# EAGLE board SP-PC (EAGLE 7.6.0), part 1 of 2
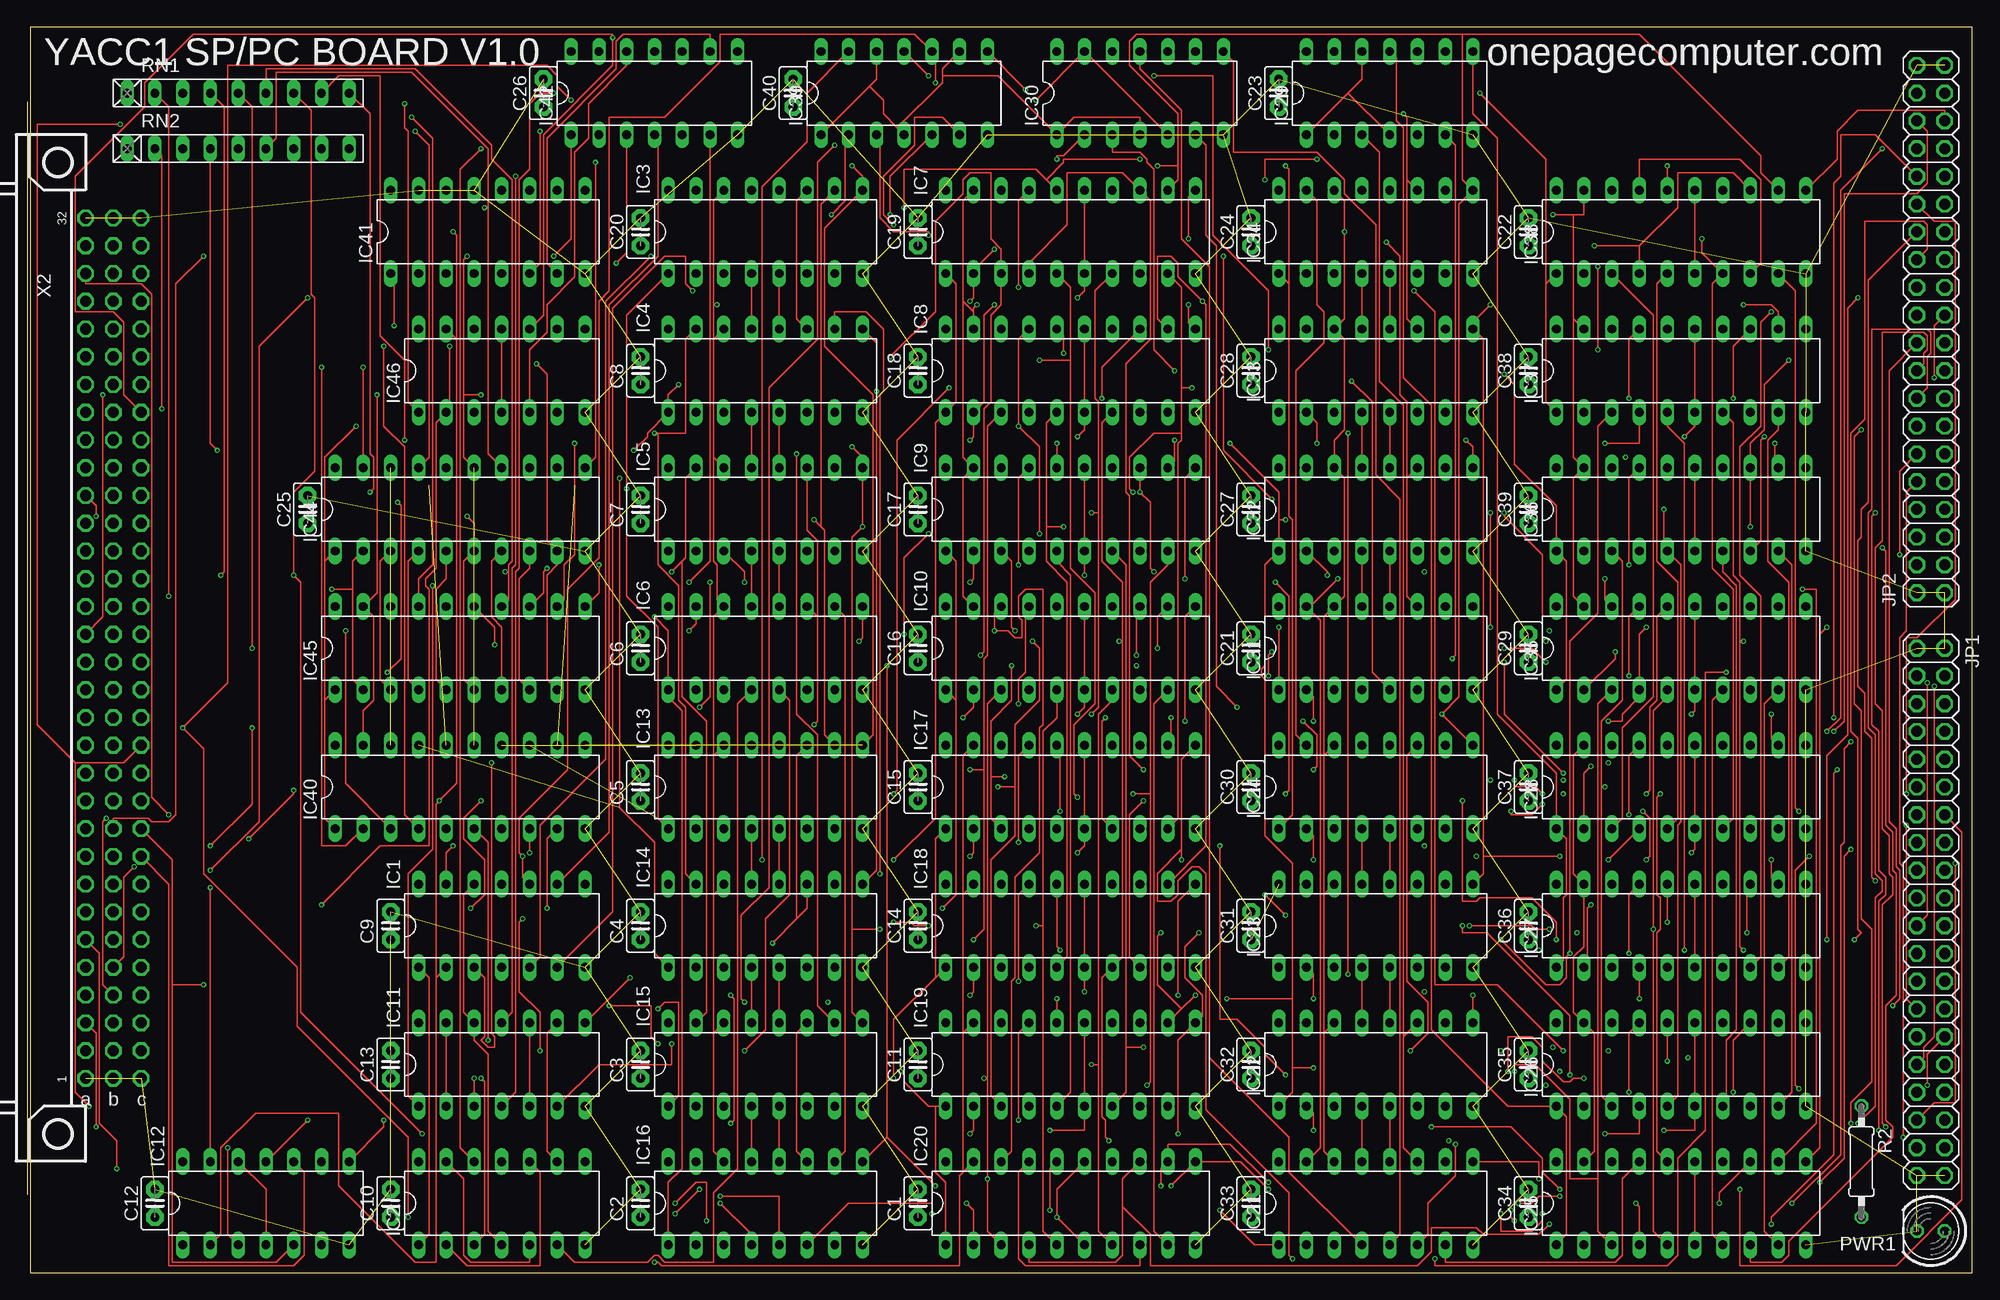
[diagram p7: board, top side]
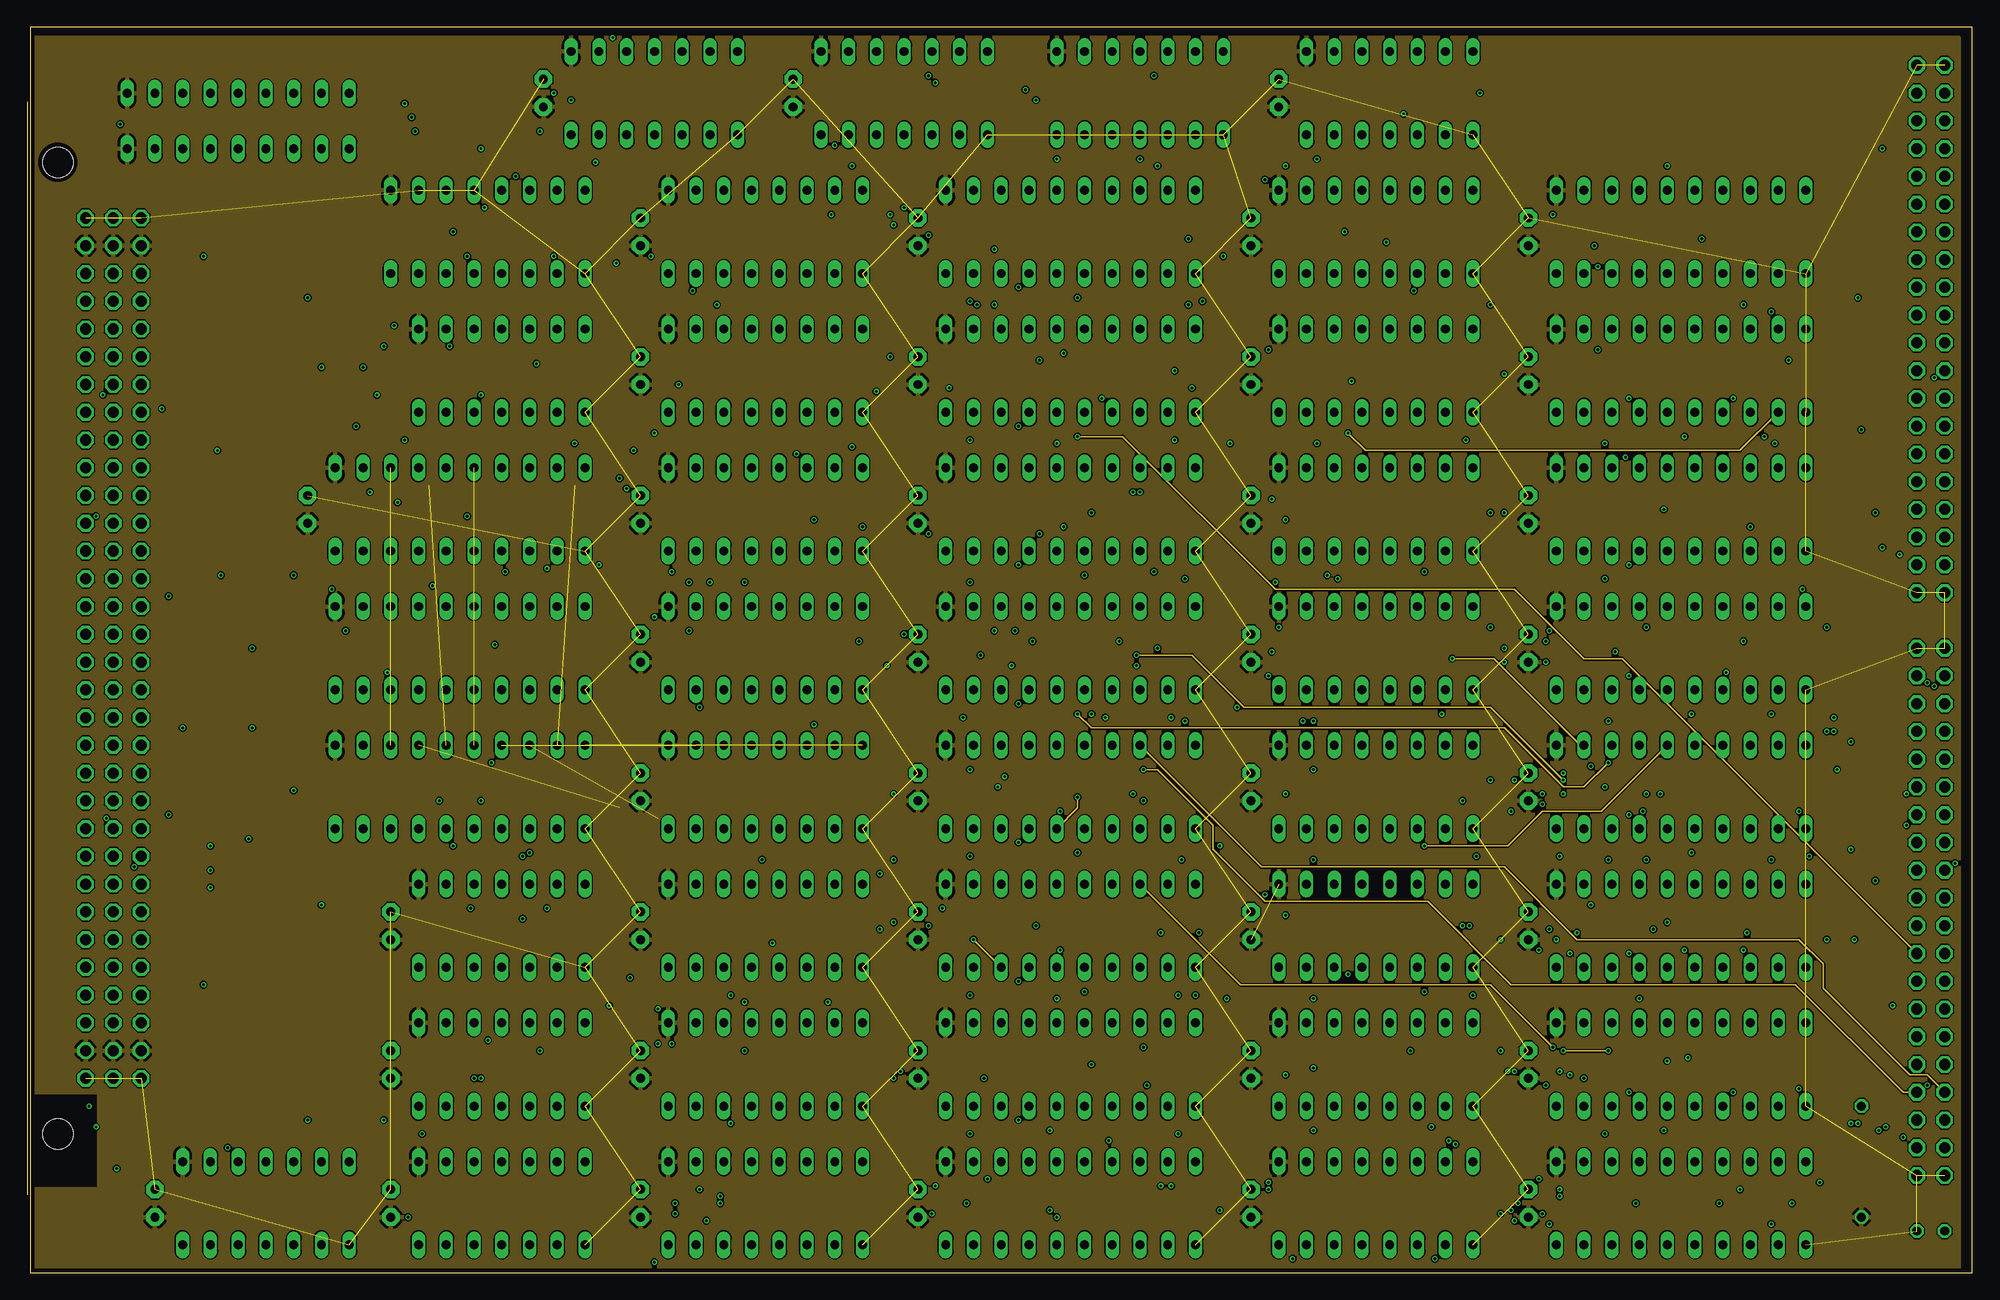
[diagram p8: board, inner layer Route2]
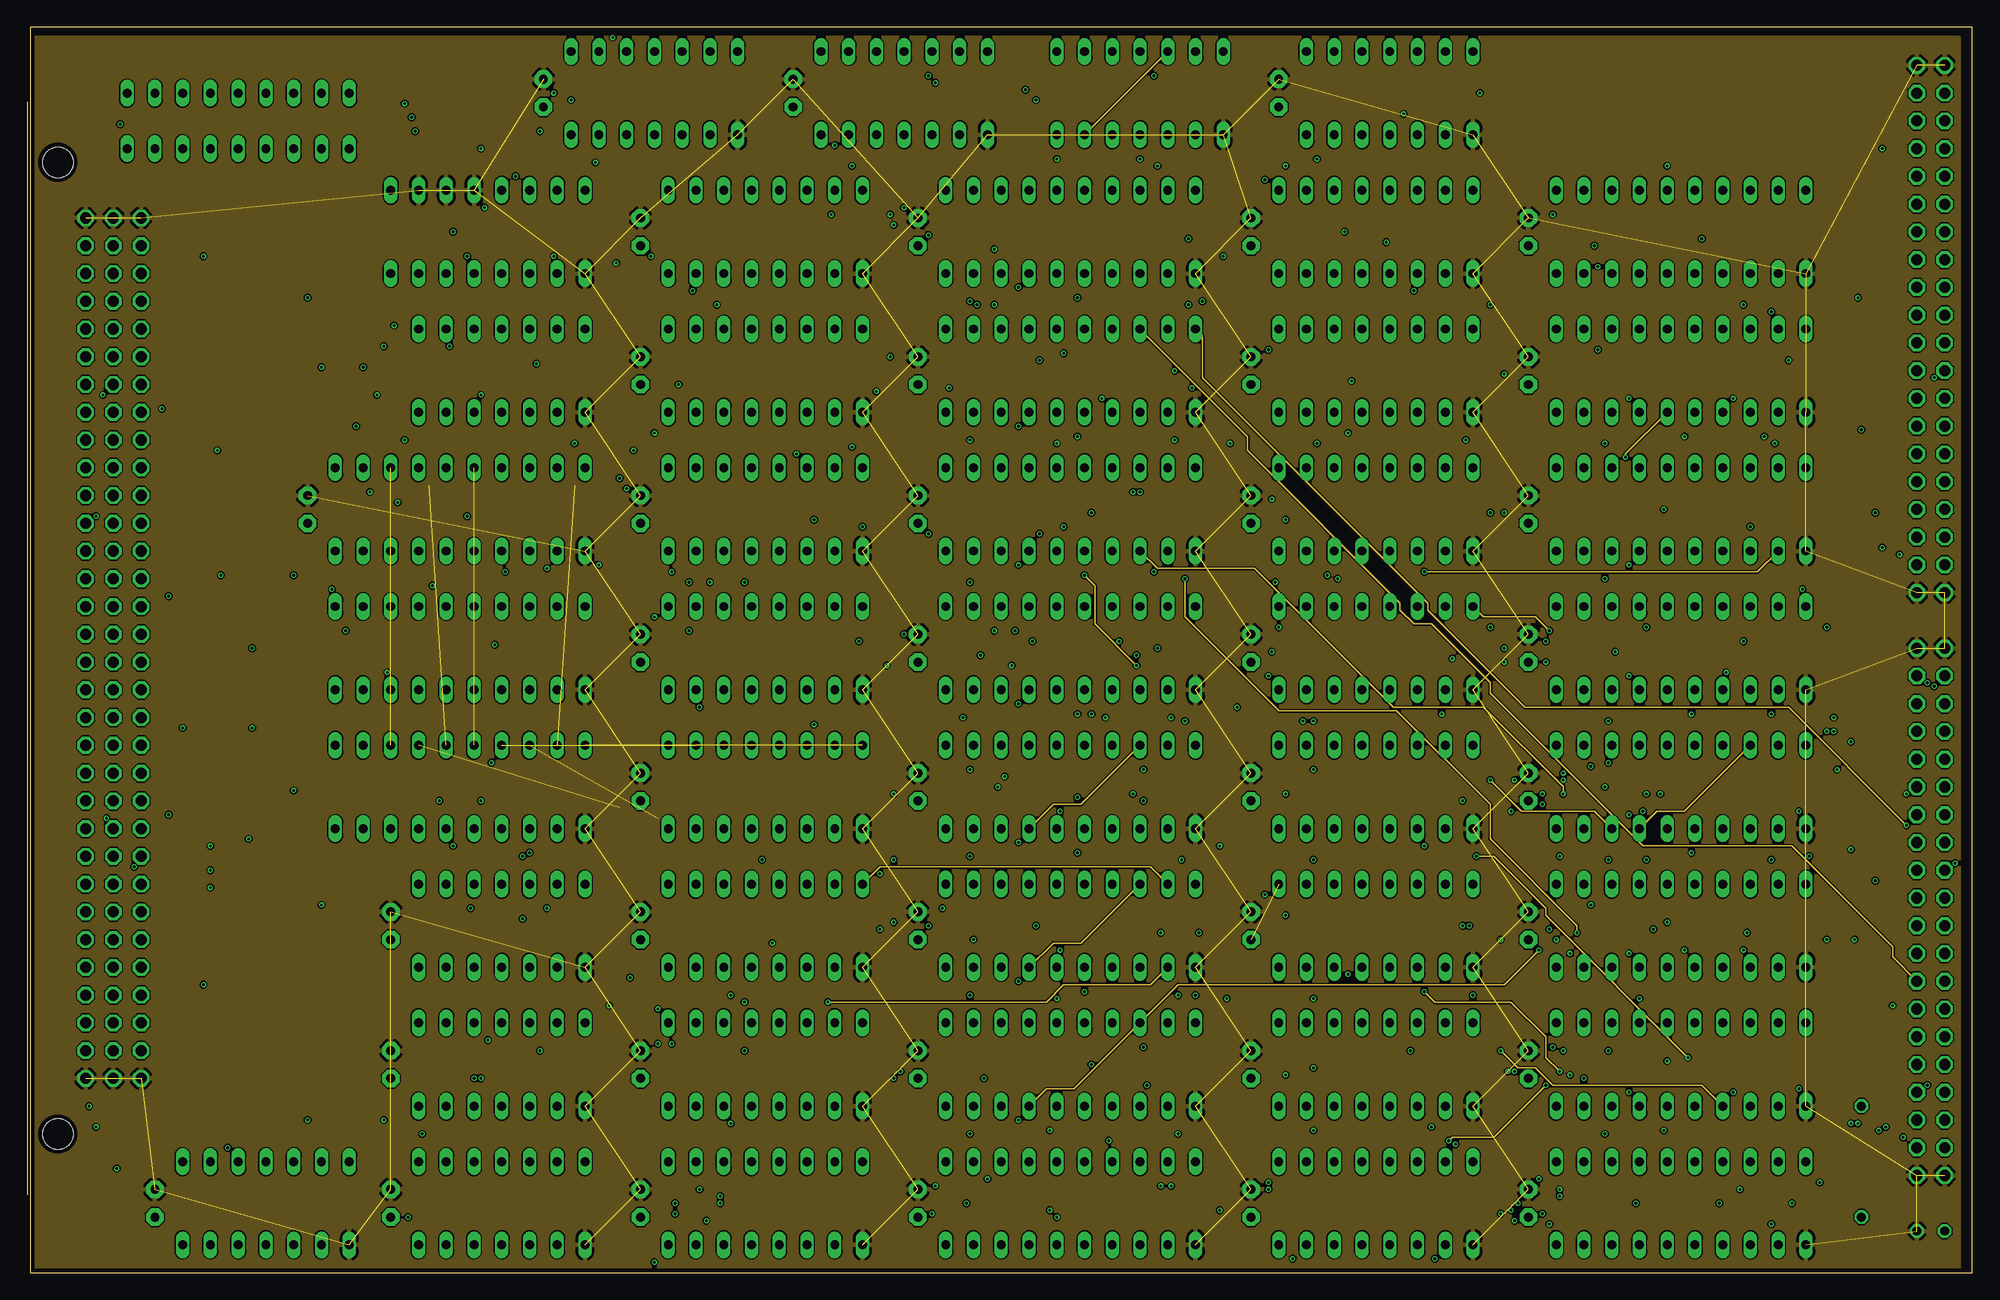
[diagram p9: board, inner layer Route15]
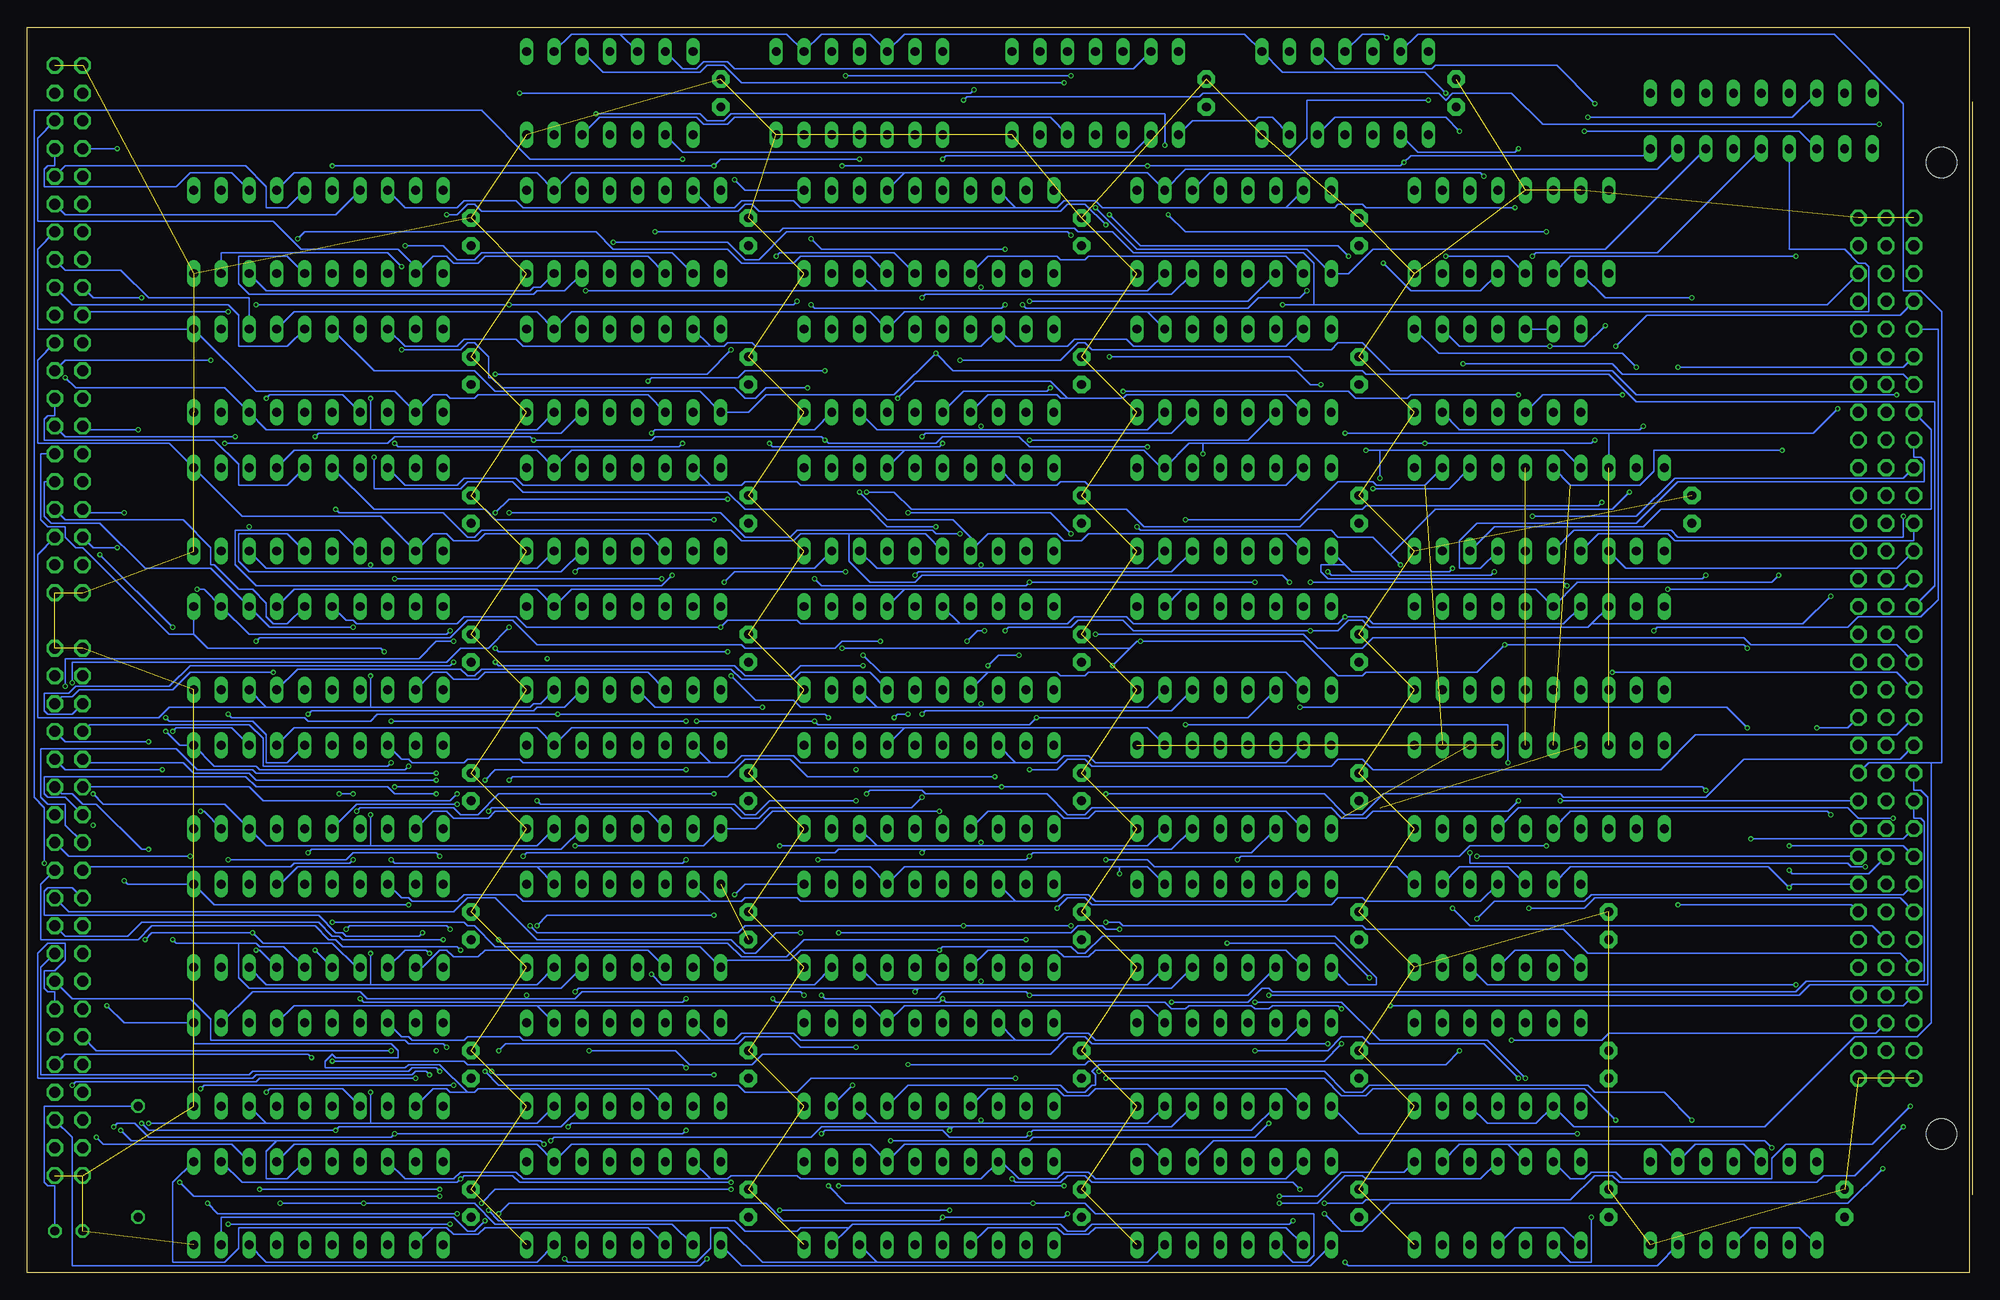
[diagram p10: board, bottom side, seen from below]

Size 177.78 x 113.97 mm. Coordinates in mm from the lower left corner, seen from the top.
Outline: 0,0 177.78,0 177.78,113.97 0,113.97 0,0
Copper layers (1*2*15*16): Top 0.035559375mm / dielectric 0.17018125mm / Route2 0.01778125mm / dielectric 47mil / Route15 0.01778125mm / dielectric 0.17018125mm / Bottom 0.035559375mm
Design rules "OSHPark-4layer": minimum track width 5mil, minimum drill 10mil, track to track 5mil, track to pad 5mil, pad to pad 5mil, via to via 5mil, smd to smd 5mil, copper to edge 15mil, drill to drill 6mil, minimum pad ring 4mil, minimum via ring 4mil, stop-mask expansion 2.5mil, vias tented up to drill 0mil, thermal gap 10mil

## Footprints (pad centres in the part's own frame; a part is rotated, then mirrored left to right if it is on the bottom)
C2.5-2 = drill 0.813 pad 1.6 octagon: 1 -1.27,0; 2 1.27,0
DIL14 = drill 0.813 long: 1 -7.62,-3.81; 2 -5.08,-3.81; 3 -2.54,-3.81; 4 0,-3.81; 5 2.54,-3.81; 6 5.08,-3.81; 7 7.62,-3.81; 8 7.62,3.81; 9 5.08,3.81; 10 2.54,3.81; 11 0,3.81; 12 -2.54,3.81; 13 -5.08,3.81; 14 -7.62,3.81
DIL16 = drill 0.813 long: 1 -8.89,-3.81; 2 -6.35,-3.81; 3 -3.81,-3.81; 4 -1.27,-3.81; 5 1.27,-3.81; 6 3.81,-3.81; 7 6.35,-3.81; 8 8.89,-3.81; 9 8.89,3.81; 10 6.35,3.81; 11 3.81,3.81; 12 1.27,3.81; 13 -1.27,3.81; 14 -3.81,3.81; 15 -6.35,3.81; 16 -8.89,3.81
DIL20 = drill 0.813 long: 1 -11.43,-3.81; 2 -8.89,-3.81; 3 -6.35,-3.81; 4 -3.81,-3.81; 5 -1.27,-3.81; 6 1.27,-3.81; 7 3.81,-3.81; 8 6.35,-3.81; 9 8.89,-3.81; 10 11.43,-3.81; 11 11.43,3.81; 12 8.89,3.81; 13 6.35,3.81; 14 3.81,3.81; 15 1.27,3.81; 16 -1.27,3.81; 17 -3.81,3.81; 18 -6.35,3.81; 19 -8.89,3.81; 20 -11.43,3.81
2X20 = drill 1.016 octagon: 1 -24.13,-1.27; 2 -24.13,1.27; 3 -21.59,-1.27; 4 -21.59,1.27; 5 -19.05,-1.27; 6 -19.05,1.27; 7 -16.51,-1.27; 8 -16.51,1.27; 9 -13.97,-1.27; 10 -13.97,1.27; 11 -11.43,-1.27; 12 -11.43,1.27; 13 -8.89,-1.27; 14 -8.89,1.27; 15 -6.35,-1.27; 16 -6.35,1.27; 17 -3.81,-1.27; 18 -3.81,1.27; 19 -1.27,-1.27; 20 -1.27,1.27; 21 1.27,-1.27; 22 1.27,1.27; 23 3.81,-1.27; 24 3.81,1.27; 25 6.35,-1.27; 26 6.35,1.27; 27 8.89,-1.27; 28 8.89,1.27; 29 11.43,-1.27; 30 11.43,1.27; 31 13.97,-1.27; 32 13.97,1.27; 33 16.51,-1.27; 34 16.51,1.27; 35 19.05,-1.27; 36 19.05,1.27; 37 21.59,-1.27; 38 21.59,1.27; 39 24.13,-1.27; 40 24.13,1.27
LED5MM = drill 0.813 octagon: A -1.27,0; K 1.27,0
0207/10 = drill 0.813 octagon: 1 -5.08,0; 2 5.08,0
RN-9 = drill 0.813 long: 1 -10.16,0; 2 -7.62,0; 3 -5.08,0; 4 -2.54,0; 5 0,0; 6 2.54,0; 7 5.08,0; 8 7.62,0; 9 10.16,0
FABC96R = drill 1.016 octagon: A1 -2.54,39.37; A2 -2.54,36.83; A3 -2.54,34.29; A4 -2.54,31.75; A5 -2.54,29.21; A6 -2.54,26.67; A7 -2.54,24.13; A8 -2.54,21.59; A9 -2.54,19.05; A10 -2.54,16.51; A11 -2.54,13.97; A12 -2.54,11.43; A13 -2.54,8.89; A14 -2.54,6.35; A15 -2.54,3.81; A16 -2.54,1.27; A17 -2.54,-1.27; A18 -2.54,-3.81; A19 -2.54,-6.35; A20 -2.54,-8.89; A21 -2.54,-11.43; A22 -2.54,-13.97; A23 -2.54,-16.51; A24 -2.54,-19.05; A25 -2.54,-21.59; A26 -2.54,-24.13; A27 -2.54,-26.67; A28 -2.54,-29.21; A29 -2.54,-31.75; A30 -2.54,-34.29; A31 -2.54,-36.83; A32 -2.54,-39.37; B1 -5.08,39.37; B2 -5.08,36.83; B3 -5.08,34.29; B4 -5.08,31.75; B5 -5.08,29.21; B6 -5.08,26.67; B7 -5.08,24.13; B8 -5.08,21.59; B9 -5.08,19.05; B10 -5.08,16.51; B11 -5.08,13.97; B12 -5.08,11.43; B13 -5.08,8.89; B14 -5.08,6.35; B15 -5.08,3.81; B16 -5.08,1.27; B17 -5.08,-1.27; B18 -5.08,-3.81; B19 -5.08,-6.35; B20 -5.08,-8.89; B21 -5.08,-11.43; B22 -5.08,-13.97; B23 -5.08,-16.51; B24 -5.08,-19.05; B25 -5.08,-21.59; B26 -5.08,-24.13; B27 -5.08,-26.67; B28 -5.08,-29.21; B29 -5.08,-31.75; B30 -5.08,-34.29; B31 -5.08,-36.83; B32 -5.08,-39.37; C1 -7.62,39.37; C2 -7.62,36.83; C3 -7.62,34.29; C4 -7.62,31.75; C5 -7.62,29.21; C6 -7.62,26.67; C7 -7.62,24.13; C8 -7.62,21.59; C9 -7.62,19.05; C10 -7.62,16.51; C11 -7.62,13.97; C12 -7.62,11.43; C13 -7.62,8.89; C14 -7.62,6.35; C15 -7.62,3.81; C16 -7.62,1.27; C17 -7.62,-1.27; C18 -7.62,-3.81; C19 -7.62,-6.35; C20 -7.62,-8.89; C21 -7.62,-11.43; C22 -7.62,-13.97; C23 -7.62,-16.51; C24 -7.62,-19.05; C25 -7.62,-21.59; C26 -7.62,-24.13; C27 -7.62,-26.67; C28 -7.62,-29.21; C29 -7.62,-31.75; C30 -7.62,-34.29; C31 -7.62,-36.83; C32 -7.62,-39.37 | hole 2.794: 0,-44.456; 0,44.456

## Placement (x,y rotation side)
C1  0.1  [C2.5-2]  81.28,6.35 90 top
C2  0.1  [C2.5-2]  55.88,6.35 90 top
C3  0.1  [C2.5-2]  55.88,19.05 90 top
C4  0.1  [C2.5-2]  55.88,31.75 90 top
C5  0.1  [C2.5-2]  55.88,44.45 90 top
C6  0.1  [C2.5-2]  55.88,57.15 90 top
C7  0.1  [C2.5-2]  55.88,69.85 90 top
C8  0.1  [C2.5-2]  55.88,82.55 90 top
C9  0.1  [C2.5-2]  33.02,31.75 90 top
C10  0.1  [C2.5-2]  33.02,6.35 90 top
C11  0.1  [C2.5-2]  81.28,19.05 90 top
C12  0.1  [C2.5-2]  11.43,6.35 90 top
C13  0.1  [C2.5-2]  33.02,19.05 90 top
C14  0.1  [C2.5-2]  81.28,31.75 90 top
C15  0.1  [C2.5-2]  81.28,44.45 90 top
C16  0.1  [C2.5-2]  81.28,57.15 90 top
C17  0.1  [C2.5-2]  81.28,69.85 90 top
C18  0.1  [C2.5-2]  81.28,82.55 90 top
C19  0.1  [C2.5-2]  81.28,95.25 90 top
C20  0.1  [C2.5-2]  55.88,95.25 90 top
C21  0.1  [C2.5-2]  111.76,57.15 90 top
C22  0.1  [C2.5-2]  137.16,95.25 90 top
C23  0.1  [C2.5-2]  114.3,107.95 90 top
C24  0.1  [C2.5-2]  111.76,95.25 90 top
C25  0.1  [C2.5-2]  25.4,69.85 90 top
C26  0.1  [C2.5-2]  46.99,107.95 90 top
C27  0.1  [C2.5-2]  111.76,69.85 90 top
C28  0.1  [C2.5-2]  111.76,82.55 90 top
C29  0.1  [C2.5-2]  137.16,57.15 90 top
C30  0.1  [C2.5-2]  111.76,44.45 90 top
C31  0.1  [C2.5-2]  111.76,31.75 90 top
C32  0.1  [C2.5-2]  111.76,19.05 90 top
C33  0.1  [C2.5-2]  111.76,6.35 90 top
C34  0.1  [C2.5-2]  137.16,6.35 90 top
C35  0.1  [C2.5-2]  137.16,19.05 90 top
C36  0.1  [C2.5-2]  137.16,31.75 90 top
C37  0.1  [C2.5-2]  137.16,44.45 90 top
C38  0.1  [C2.5-2]  137.16,82.55 90 top
C39  0.1  [C2.5-2]  137.16,69.85 90 top
C40  0.1  [C2.5-2]  69.85,107.95 90 top
IC1  7400N  [DIL14]  43.18,31.75 0 top
IC2  7400N  [DIL14]  43.18,6.35 0 top
IC3  74LS192N  [DIL16]  67.31,95.25 0 top
IC4  74LS192N  [DIL16]  67.31,82.55 0 top
IC5  74LS192N  [DIL16]  67.31,69.85 0 top
IC6  74LS192N  [DIL16]  67.31,57.15 0 top
IC7  74LS244N  [DIL20]  95.25,95.25 0 top
IC8  74LS244N  [DIL20]  95.25,82.55 0 top
IC9  74LS244N  [DIL20]  95.25,69.85 0 top
IC10  74LS244N  [DIL20]  95.25,57.15 0 top
IC11  7400N  [DIL14]  43.18,19.05 0 top
IC12  7400N  [DIL14]  21.59,6.35 0 top
IC13  74LS192N  [DIL16]  67.31,44.45 0 top
IC14  74LS192N  [DIL16]  67.31,31.75 0 top
IC15  74LS192N  [DIL16]  67.31,19.05 0 top
IC16  74LS192N  [DIL16]  67.31,6.35 0 top
IC17  74LS244N  [DIL20]  95.25,44.45 0 top
IC18  74LS244N  [DIL20]  95.25,31.75 0 top
IC19  74LS244N  [DIL20]  95.25,19.05 0 top
IC20  74LS244N  [DIL20]  95.25,6.35 0 top
IC21  74LS192N  [DIL16]  123.19,6.35 0 top
IC22  74LS192N  [DIL16]  123.19,19.05 0 top
IC23  74LS192N  [DIL16]  123.19,31.75 0 top
IC24  74LS192N  [DIL16]  123.19,44.45 0 top
IC25  74LS244N  [DIL20]  151.13,6.35 0 top
IC26  74LS244N  [DIL20]  151.13,19.05 0 top
IC27  74LS244N  [DIL20]  151.13,31.75 0 top
IC28  74LS244N  [DIL20]  151.13,44.45 0 top
IC29  7400N  [DIL14]  124.46,107.95 0 top
IC30  7400N  [DIL14]  101.6,107.95 0 top
IC31  74LS192N  [DIL16]  123.19,57.15 0 top
IC32  74LS192N  [DIL16]  123.19,69.85 0 top
IC33  74LS192N  [DIL16]  123.19,82.55 0 top
IC34  74LS192N  [DIL16]  123.19,95.25 0 top
IC35  74LS244N  [DIL20]  151.13,57.15 0 top
IC36  74LS244N  [DIL20]  151.13,69.85 0 top
IC37  74LS244N  [DIL20]  151.13,82.55 0 top
IC38  74LS244N  [DIL20]  151.13,95.25 0 top
IC39  7400N  [DIL14]  80.01,107.95 0 top
IC40  74LS245N  [DIL20]  39.37,44.45 0 top
IC41  74LS139N  [DIL16]  41.91,95.25 0 top
IC42  74LS04N  [DIL14]  57.15,107.95 0 top
IC44  74LS245N  [DIL20]  39.37,69.85 0 top
IC45  74LS245N  [DIL20]  39.37,57.15 0 top
IC46  74LS00N  [DIL14]  43.18,82.55 0 top
JP1  [2X20]  173.99,33.02 270 top
JP2  [2X20]  173.99,86.36 90 top
PWR1  [LED5MM]  173.99,3.81 180 top
R2  330  [0207/10]  167.64,10.16 270 top
RN1  [RN-9]  19.05,107.95 0 top
RN2  [RN-9]  19.05,102.87 0 top
X2  FABC96R  [FABC96R]  2.54,57.15 180 top

## Tracks (layer width: path | path; a pad name or v marks a point on that pad's centre or on a via)
-INDIRECT0  (via drill 0.25)
  Top 0.127: IC41.6 46.67,92.39 v46.67,104.46
  Bottom 0.127: v46.67,104.46 47.94,105.73 58.1,105.73 IC42.5
-INDIRECT1
  Top 0.127: IC41.7 47.31,92.39 47.31,103.82 53.66,110.17 53.66,112.71 54.29,113.35 62.23,113.35 IC42.9
-PC  (via drill 0.25)
  Top 0.127: v53.66,92.39 54.61,93.34 IC42.3
  Bottom 0.127: IC41.5 44.77,89.85 51.12,89.85 v53.66,92.39
-SP  (via drill 0.25)
  Top 0.127: v47.94,93.03 49.53,94.61 IC42.1
  Bottom 0.127: IC41.4 42.23,93.03 v47.94,93.03
ADATA0  (via drill 0.25)
  Top 0.127: v60.33,58.74 60.96,59.37 IC6.15 | IC10.18 88.27,60.33 v88.27,58.74 89.53,58.74 90.17,58.1 90.81,58.1 90.81,59.69 90.49,60.01 90.49,61.91 91.12,62.55 92.71,62.55 92.71,50.16 92.39,49.85 92.39,38.42 90.17,36.2 90.17,26.99 89.85,26.67 89.85,11.11 IC20.18 | RN1.2 12.7,106.68 v12.7,61.91 | 117.16,60.64 118.11,59.69 118.11,11.43 IC21.15 | IC35.18 144.15,61.59 v144.15,63.5 | v119.7,63.5 117.16,60.96 117.16,60.64 | 117.16,60.64 IC31.15
  Bottom 0.127: 34.61,59.37 34.92,59.05 54.93,59.05 55.56,59.69 56.83,59.69 57.78,58.74 v60.33,58.74 76.52,58.74 77.47,59.69 81.6,59.69 82.23,59.05 87.95,59.05 v88.27,58.74 | 34.61,59.37 IC45.18 | v12.7,61.91 15.24,59.37 34.61,59.37 | IC16.15 62.55,8.57 80.01,8.57 80.64,9.21 82.87,9.21 83.5,8.57 87,8.57 88.58,10.16 IC20.18 90.49,8.57 107,8.57 107.31,8.89 113.35,8.89 113.67,8.57 115.25,8.57 | 115.25,8.57 IC21.15 | IC25.18 143.19,8.57 138.75,8.57 138.11,9.21 133.03,9.21 132.4,8.57 115.25,8.57 | v119.7,63.5 v144.15,63.5
ADATA1  (via drill 0.25)
  Top 0.127: IC25.16 148.91,11.11 148.91,31.11 149.22,31.43 149.22,34.29 148.91,34.61 148.91,43.5 v149.22,43.81 | v147.96,43.81 148.27,44.13 148.27,51.75 148.91,52.39 148.91,60.01 IC35.16 | v57.15,60.01 58.42,58.74 IC6.1 58.42,52.7 59.69,51.44 59.69,9.53 58.42,8.26 IC16.1 | IC20.16 93.34,9.53 v93.34,5.71 | v108.9,5.71 112.08,2.54 IC21.1 | v34.92,105.73 36.83,103.82 36.83,64.77 35.56,63.5 IC45.17 | v114.3,59.05 IC31.1
  Bottom 0.127: v147.96,43.81 v149.22,43.81 | IC45.17 37.15,59.37 54.61,59.37 55.24,60.01 v57.15,60.01 57.78,59.37 76.52,59.37 77.15,60.01 81.92,60.01 82.55,59.37 92.39,59.37 | IC21.1 112.39,0.64 60.33,0.64 IC16.1 | v108.9,5.71 v93.34,5.71 | RN1.3 16.19,105.73 v34.92,105.73 | 92.39,59.37 IC10.16 | 92.39,59.37 107,59.37 107.31,59.69 113.67,59.69 v114.3,59.05 132.08,59.05 133.03,60.01 137.79,60.01 138.43,59.37 147.64,59.37 147.96,59.69 148.59,59.69 IC35.16
ADATA2  (via drill 0.25)
  Top 0.127: RN1.4 17.78,106.68 17.78,64.14 v17.46,63.82 | IC16.10 74.61,11.11 74.61,60.01 IC6.10
  Bottom 0.127: IC16.10 75.25,11.75 97.47,11.75 IC20.14 100.65,11.75 127.95,11.75 IC21.10 131.13,11.75 153.35,11.75 IC25.14 | IC35.14 153.35,62.55 131.13,62.55 IC31.10 127.95,62.55 97.47,62.55 | 72.07,62.55 39.69,62.55 IC45.16 35.88,63.18 18.1,63.18 v17.46,63.82 | IC6.10 72.07,62.55 | 97.47,62.55 IC10.14 | 72.07,62.55 97.47,62.55
ADATA3  (via drill 0.25)
  Top 0.127: IC21.9 138.11,10.16 v138.11,8.57 | IC45.15 42.55,59.05 v42.55,57.47 | v75.88,57.78 76.2,58.1 IC6.9 | RN1.5 20.32,106.68 v20.32,57.15 | 78.42,12.38 IC16.9 | v78.42,55.56 78.42,12.38 | v103.5,7.94 103.5,9.53 IC20.12 104.14,11.75 109.86,11.75 v113.35,8.26 | 78.42,12.38 v82.87,7.94 | IC10.12 103.19,60.01 v103.19,57.15 | v162.24,62.55 163.51,62.55 163.51,13.65 IC25.12
  Route15 0.127: IC31.9 133.03,60.01 137.79,60.01 v139.06,58.74
  Bottom 0.127: v139.06,58.74 139.38,58.42 157.48,58.42 IC35.12 161.61,62.55 v162.24,62.55 | IC25.12 158.12,8.26 138.43,8.26 v138.11,8.57 137.79,8.89 133.35,8.89 132.72,8.26 v113.35,8.26 | v20.32,57.15 20.64,57.47 v42.55,57.47 45.09,54.93 55.24,54.93 55.56,54.61 57.78,54.61 60.96,57.78 v75.88,57.78 76.2,57.78 76.83,57.15 | 76.83,57.15 v78.42,55.56 | v82.87,7.94 v103.5,7.94 | 76.83,57.15 v103.19,57.15
ADATA4  (via drill 0.25)
  Top 0.127: IC45.14 43.81,61.59 43.81,64.14 | 43.81,64.14 43.81,64.77 44.13,65.09 44.13,100.01 42.23,101.92 42.23,103.19 35.24,110.17 21.59,110.17 RN1.6 | v43.5,64.14 43.81,64.14 | 59.69,65.09 60.01,65.41 60.01,72.71 IC5.15 | 59.69,65.09 v58.74,64.14 | IC15.15 61.91,23.81 61.91,50.48 59.69,52.7 59.69,65.09
  Bottom 0.127: IC15.15 62.55,21.27 80.01,21.27 80.64,21.91 82.87,21.91 83.5,21.27 87.31,21.27 | IC19.18 87.31,21.27 | 115.25,21.27 IC22.15 | 115.25,21.27 113.03,21.27 112.39,21.91 107.63,21.91 107,21.27 87.31,21.27 | IC26.18 143.51,21.59 142.88,21.59 142.56,21.27 137.79,21.27 137.48,21.59 132.72,21.59 132.4,21.27 115.25,21.27 | IC5.15 62.55,72.07 80.64,72.07 80.96,72.39 83.19,72.39 83.5,72.07 87.31,72.07 | IC9.18 87.31,72.07 | 115.25,72.07 IC32.15 | 115.25,72.07 112.39,72.07 112.08,72.39 107.31,72.39 107,72.07 87.31,72.07 | IC36.18 143.19,72.07 138.43,72.07 137.79,72.71 133.03,72.71 132.4,72.07 115.25,72.07 | v43.5,64.14 43.81,63.82 58.42,63.82 v58.74,64.14
ADATA5  (via drill 0.25)
  Top 0.127: IC22.1 115.57,16.51 115.57,18.73 | 115.57,25.08 115.57,37.47 113.03,40.01 113.03,54.29 112.71,54.61 112.71,55.24 113.03,55.56 113.03,64.77 IC32.1 114.3,68.9 | 115.57,25.08 115.57,18.73 | v93.98,25.08 IC19.16 | 115.57,25.08 v109.54,25.08 | v93.98,75.88 IC9.16 | v109.86,75.88 114.3,71.44 114.3,68.9 | v149.86,19.37 IC26.16 | 115.57,18.73 v117.47,18.73 | 114.3,68.9 v114.94,68.9 | IC45.13 46.99,62.23 46.99,64.14 v47.31,64.45 | RN1.7 25.72,106.36 25.72,89.53 26.04,89.22 26.04,73.34 24.13,71.44 v24.13,63.82 24.77,63.18 24.77,23.81 v35.88,12.7 | v57.47,24.13 58.1,24.77 59.37,24.77 59.37,16.19 IC15.1
  Bottom 0.127: v109.54,25.08 109.22,24.77 94.3,24.77 v93.98,25.08 93.66,24.77 73.66,24.77 73.03,24.13 71.75,24.13 71.44,24.45 65.72,24.45 65.41,24.13 64.14,24.13 63.82,24.45 57.78,24.45 v57.47,24.13 | v93.98,75.88 94.3,75.56 109.54,75.56 v109.86,75.88 | v149.86,19.37 137.79,19.37 137.48,19.05 117.79,19.05 v117.47,18.73 | IC36.16 146.05,69.85 135.89,69.85 134.94,68.9 v114.94,68.9 | v47.31,64.45 47.62,64.14 56.52,64.14 57.15,64.77 | IC5.1 57.15,64.77 | v24.13,63.82 24.45,63.5 58.74,63.5 59.37,64.14 59.37,64.77 57.15,64.77 | IC15.1 55.88,12.7 v35.88,12.7
ADATA6  (via drill 0.25)
  Top 0.127: IC45.12 48.9,61.59 48.9,64.77 49.85,65.72 v49.85,75.88 | RN1.8 28.26,109.54 32.07,109.54 32.07,85.72 34.29,83.5 v34.29,76.2 | IC15.10 72.07,24.45 72.07,49.21 70.17,51.12 v70.17,74.93
  Bottom 0.127: IC15.10 75.25,24.45 97.47,24.45 IC19.14 100.65,24.45 131.13,24.45 | 131.13,24.45 IC22.10 | 131.13,24.45 153.35,24.45 IC26.14 | IC36.14 153.35,75.25 131.13,75.25 IC32.10 127.95,75.25 97.47,75.25 | 70.17,75.88 71.44,75.88 IC5.10 73.98,73.66 75.56,75.25 97.47,75.25 | 70.17,75.88 v49.85,75.88 34.61,75.88 v34.29,76.2 | 97.47,75.25 IC9.14 | 70.17,75.88 v70.17,74.93
ADATA7  (via drill 0.25)
  Top 0.127: IC9.12 104.78,74.3 v104.78,76.2 | v131.44,76.2 132.08,75.56 IC32.9 | IC36.12 159.7,73.98 v159.7,75.88 | v106.68,25.4 105.41,24.13 | 105.41,24.13 IC19.12 | v132.08,25.4 IC22.9 | IC45.11 52.07,62.23 v52.07,64.77 | RN1.9 31.11,106.05 31.11,74.93 31.43,74.61 31.43,71.75 v31.11,71.44 | IC15.9 75.25,23.81 75.25,31.43 | 75.25,31.43 75.25,67.31 v76.2,68.26 IC5.9 76.2,74.61 v75.25,75.56 | 105.41,24.13 103.19,26.35 103.19,30.8 v103.5,31.11 | 75.25,31.43 v77.79,31.43
  Bottom 0.127: v159.7,75.88 144.78,75.88 144.15,76.52 131.76,76.52 v131.44,76.2 120.65,76.2 120.33,76.52 105.09,76.52 v104.78,76.2 104.46,75.88 94.61,75.88 93.98,76.52 87,76.52 86.04,75.56 v75.25,75.56 | v106.68,25.4 107,25.72 127,25.72 127.64,25.08 132.08,25.08 | 132.08,25.08 146.69,25.08 147.32,25.72 157.16,25.72 IC26.12 | 132.08,25.08 v132.08,25.4 | 53.02,65.72 54.61,67.31 57.78,67.31 58.42,67.94 75.88,67.94 v76.2,68.26 | 53.02,65.72 v52.07,64.77 | v31.11,71.44 32.7,69.85 48.9,69.85 53.02,65.72 | v103.5,31.11 82.23,31.11 81.6,31.75 79.38,31.75 79.06,31.43 v77.79,31.43
ADATA8  (via drill 0.25)  (1 unrouted)
  Top 0.127: 57.47,76.83 60.01,76.83 60.01,85.41 IC4.15 | 57.47,76.83 v57.15,76.83 | RN2.2 12.06,102.23 v12.06,79.06 | IC14.15 60.01,36.51 60.01,51.75 59.37,52.39 59.37,62.87 57.47,64.77 57.47,76.83
  Bottom 0.127: IC14.15 62.55,33.97 80.01,33.97 80.64,34.61 82.87,34.61 83.5,33.97 87.31,33.97 | IC18.18 87.31,33.97 | 115.25,33.97 IC23.15 | 115.25,33.97 112.39,33.97 112.08,34.29 107.31,34.29 107,33.97 87.31,33.97 | IC27.18 143.51,34.29 142.88,34.29 142.56,33.97 138.43,33.97 137.79,34.61 133.03,34.61 132.4,33.97 115.25,33.97 | 115.25,84.77 113.98,84.77 113.67,85.09 111.44,85.09 111.12,84.77 90.49,84.77 IC8.18 87.31,84.77 82.55,84.77 81.92,85.41 77.15,85.41 76.52,84.77 62.55,84.77 IC4.15 | IC33.15 115.25,84.77 | IC37.18 143.19,84.77 138.43,84.77 137.79,85.41 133.03,85.41 132.4,84.77 115.25,84.77 | 33.02,76.83 IC44.18 | v57.15,76.83 33.02,76.83 | v12.06,79.06 14.29,76.83 33.02,76.83
ADATA9  (via drill 0.25)  (1 unrouted)
  Top 0.127: IC8.16 94.61,85.72 v94.61,84.14 | v94.3,29.53 93.98,29.84 IC18.16 | v149.86,32.07 IC27.16 | v55.24,75.25 56.52,76.52 56.52,76.83 IC4.1 58.42,80.33 v59.37,81.28 | v35.24,104.46 36.51,103.19 36.51,74.61 IC44.17 | IC14.1 57.15,29.21 57.15,39.37 53.98,42.55 v53.98,72.71
  Bottom 0.127: IC37.16 146.05,82.55 136.84,82.55 134.94,80.64 116.2,80.64 IC33.1 111.76,78.74 110.17,80.33 98.42,80.33 v94.61,84.14 93.03,82.55 61.59,82.55 60.33,81.28 v59.37,81.28 | v149.86,32.07 137.79,32.07 137.48,31.75 136.84,31.75 134.94,29.84 116.2,29.84 IC23.1 113.67,28.57 107.95,28.57 107,29.53 v94.3,29.53 93.98,29.84 82.23,29.84 81.6,29.21 80.96,29.21 79.38,30.8 58.1,30.8 54.29,26.99 54.29,26.35 56.83,26.35 IC14.1 | IC44.17 37.15,75.25 53.98,75.25 | v55.24,75.25 53.98,75.25 | RN2.3 15.56,104.46 v35.24,104.46 | 53.98,75.25 v53.98,72.71
ADATA10  (via drill 0.25)  (1 unrouted)
  Top 0.127: v17.14,75.25 16.51,75.88 RN2.4 | v77.79,36.51 77.79,80.33 78.11,80.64 78.11,86.36 76.52,87.95 73.66,87.95 IC4.10
  Bottom 0.127: IC14.10 75.25,37.15 77.79,37.15 | 77.79,37.15 97.47,37.15 IC18.14 100.65,37.15 131.13,37.15 | 131.13,37.15 IC23.10 | 131.13,37.15 153.03,37.15 154.62,35.56 IC27.14 | IC44.16 36.51,72.07 30.16,72.07 28.89,73.34 28.89,75.25 v17.14,75.25 | 75.25,87.95 IC4.10 | 75.25,87.95 97.47,87.95 IC8.14 100.65,87.95 127.95,87.95 IC33.10 131.13,87.95 153.35,87.95 IC37.14 | RN2.4 16.51,93.66 11.43,93.66 10.16,92.39 9.53,92.39 9.21,92.08 9.21,87.95 75.25,87.95 | v77.79,36.51 77.79,37.15
ADATA11  (via drill 0.25)  (1 unrouted)
  Top 0.127: IC18.12 107.63,39.05 107.63,88.58 v107.31,88.9 105.09,91.12 105.09,92.39 104.46,93.03 103.19,93.03 103.19,87.31 IC8.12 | IC23.9 133.03,36.51 133.03,38.1 | 133.03,38.1 133.03,85.41 IC33.9 132.08,87 v133.67,88.58 | IC27.12 159.38,36.2 v159.38,37.78 | 133.03,38.1 v140.02,38.1 | IC37.12 160.02,87.95 159.38,88.58 v156.84,88.58 | IC14.9 77.47,36.83 v77.47,80.64 77.47,85.09 IC4.9 | v40.01,93.03 39.69,92.71 39.69,80.33 | 39.69,80.33 39.69,74.61 IC44.15 | 39.69,80.33 v41.27,80.33
  Route15 0.127: IC18.12 102.55,37.15 77.79,37.15 IC14.9
  Bottom 0.127: v159.38,37.78 148.59,37.78 147.96,38.42 140.34,38.42 v140.02,38.1 | v156.84,88.58 v133.67,88.58 107.63,88.58 v107.31,88.9 | RN2.5 28.57,93.34 39.69,93.34 v40.01,93.03 | v77.47,80.64 56.83,80.64 56.2,80.01 51.44,80.01 51.12,80.33 v41.27,80.33
ADATA12  (via drill 0.25)  (1 unrouted)
  Top 0.127: IC44.14 41.91,74.93 41.91,97.47 | 41.91,97.47 41.91,102.87 34.92,109.86 22.54,109.86 22.54,103.82 RN2.6 | v41.59,97.47 41.91,97.47 | IC24.15 115.89,49.21 115.89,82.55 118.43,85.09 118.43,87.95 117.79,88.58 117.79,98.11 IC34.15
  Bottom 0.127: IC13.15 62.55,46.67 80.01,46.67 80.64,47.31 82.87,47.31 83.5,46.67 87.31,46.67 | IC17.18 87.31,46.67 | 115.25,46.67 IC24.15 | 115.25,46.67 113.03,46.67 112.39,47.31 107.63,47.31 107,46.67 87.31,46.67 | IC28.18 143.51,46.99 142.88,46.99 142.56,46.67 137.79,46.67 137.48,46.99 132.72,46.99 132.4,46.67 115.25,46.67 | 62.55,97.47 IC3.15 | 62.55,97.47 79.38,97.47 80.01,98.11 82.87,98.11 83.5,97.47 87.31,97.47 | IC7.18 87.31,97.47 | 115.25,97.47 IC34.15 | 115.25,97.47 113.03,97.47 112.39,98.11 107.63,98.11 107,97.47 87.31,97.47 | IC38.18 143.19,97.47 138.43,97.47 137.79,98.11 133.03,98.11 132.4,97.47 115.25,97.47 | v41.59,97.47 55.24,97.47 55.56,97.79 57.78,97.79 58.1,97.47 62.55,97.47
ADATA13  (via drill 0.25)  (1 unrouted)
  Top 0.127: IC17.16 94.3,47.94 v94.3,42.23 | 115.25,90.49 IC34.1 | 115.25,90.49 115.25,69.22 115.57,68.9 115.57,41.91 IC24.1 | v149.86,101.28 IC38.16 | v114.94,101.28 115.25,100.97 115.25,90.49 | IC13.1 57.47,41.59 57.47,59.05 54.61,61.91 v54.61,71.75 54.61,87.63 IC3.1 | 93.03,100.01 92.08,100.97 80.01,100.97 v80.01,97.47 | 93.03,100.01 IC7.16 | v101.6,101.92 94.61,101.92 94.61,101.6 93.03,100.01
  Route2 0.127: IC28.16 143.83,42.23 138.43,42.23 135.25,39.05 v127.64,39.05
  Bottom 0.127: v94.3,42.23 109.54,42.23 111.12,40.64 IC24.1 115.89,39.05 v127.64,39.05 | v149.86,101.28 v114.94,101.28 114.3,101.92 v101.6,101.92 | IC44.13 47.62,71.75 v54.61,71.75 | v80.01,97.47 76.2,93.66 60.64,93.66 IC3.1 56.83,91.44 54.61,93.66 33.34,93.66 RN2.7
ADATA14  (via drill 0.25)  (1 unrouted)
  Top 0.127: 72.39,68.26 72.71,67.94 72.71,49.21 IC13.10 | 72.39,68.26 v71.75,68.9 | IC3.10 72.39,97.79 72.39,68.26
  Bottom 0.127: IC38.14 153.35,100.65 131.13,100.65 IC34.10 127.95,100.65 97.47,100.65 | 97.47,100.65 75.25,100.65 IC3.10 71.75,100.97 28.57,100.97 RN2.8 | IC7.14 97.47,100.65 | IC28.14 153.35,49.85 131.13,49.85 IC24.10 127.95,49.85 97.47,49.85 | IC13.10 75.25,49.85 97.47,49.85 | IC17.14 97.47,49.85 | IC44.12 49.85,72.07 54.29,72.07 54.61,72.39 57.78,72.39 61.28,68.9 v71.75,68.9
ADATA15  (via drill 0.25)  (1 unrouted)
  Top 0.127: IC44.11 51.75,74.61 v51.75,101.6 | IC13.9 77.15,49.21 77.15,80.33 72.71,84.77 72.71,95.57 IC3.9 76.2,100.33 v75.25,101.28 | IC17.12 104.46,48.58 v104.46,50.8 | IC24.9 v129.22,51.12 130.81,52.7 130.81,97.79 IC34.9 131.13,100.01 131.13,113.35 | IC28.12 159.38,48.9 v159.38,51.12 | IC7.12 105.09,100.01 105.09,101.28 | 105.09,101.28 105.09,106.05 100.65,110.49 100.65,112.71 101.28,113.35 131.13,113.35 | IC38.12 158.43,100.65 158.43,102.23 147.32,113.35 131.13,113.35 | 105.09,101.28 v103.19,101.28
  Bottom 0.127: RN2.9 29.84,102.23 51.12,102.23 v51.75,101.6 52.07,101.28 v75.25,101.28 v103.19,101.28 | v104.46,50.8 104.78,51.12 v129.22,51.12 145.73,51.12 146.37,50.48 152.08,50.48 152.4,50.8 159.07,50.8 v159.38,51.12
ADDR0  (via drill 0.25)
  Top 0.127: IC25.9 158.75,3.81 158.75,52.07 IC35.9 | IC20.9 102.87,3.81 102.87,52.07 IC10.9 | X2.A3 6.03,21.91 v6.03,13.34 | v59.05,6.35 60.96,8.26 61.91,8.26 v61.91,4.76 | v135.89,4.76 135.57,5.08 v135.57,5.71
  Bottom 0.127: v6.03,13.34 10.48,8.89 13.34,8.89 13.97,8.26 32.07,8.26 32.7,8.89 34.29,8.89 36.51,6.67 55.24,6.67 55.56,6.35 v59.05,6.35 | v61.91,4.76 62.23,4.45 80.33,4.45 80.96,3.81 82.55,3.81 83.19,4.45 102.23,4.45 102.55,4.13 | IC20.9 102.55,4.13 | IC25.9 160.02,5.08 138.75,5.08 137.48,3.81 136.84,3.81 v135.89,4.76 | v135.57,5.71 134.62,4.76 113.03,4.76 112.08,3.81 107.31,3.81 107,4.13 102.55,4.13
ADDR1  (via drill 0.25)
  Top 0.127: IC25.7 153.99,3.49 153.99,52.39 IC35.7 | IC20.7 97.79,3.81 97.79,19.05 | 97.79,19.05 97.79,51.12 99.06,52.39 IC10.7 | v53.02,24.45 56.83,24.45 56.83,21.59 v57.47,20.95 | 97.79,19.05 v97.16,19.05
  Bottom 0.127: X2.A4 6.03,24.45 v53.02,24.45 | v57.47,20.95 59.05,19.37 80.64,19.37 80.96,19.05 v97.16,19.05 | IC35.7 153.03,55.24 138.11,55.24 137.48,54.61 136.84,54.61 136.21,55.24 113.35,55.24 112.39,54.29 107.63,54.29 107,54.93 100.65,54.93 IC10.7
ADDR2  (via drill 0.25)
  Top 0.127: IC25.5 148.59,3.81 v148.59,31.43 148.59,51.44 149.86,52.7 IC35.5 | IC20.5 92.71,3.81 92.71,31.75 | 92.71,31.75 92.71,49.53 93.98,50.8 IC10.5 | v79.06,32.07 80.64,32.07 80.96,31.75 v82.23,31.75 | 92.71,31.75 v92.08,31.75 | v139.06,31.43 137.79,31.43 137.48,31.75 v131.76,31.75
  Bottom 0.127: X2.A5 6.35,29.21 34.92,29.21 37.15,31.43 55.24,31.43 55.56,31.75 77.47,31.75 77.79,32.07 v79.06,32.07 | v82.23,31.75 v92.08,31.75 112.08,31.75 112.71,31.11 131.13,31.11 v131.76,31.75 | v148.59,31.43 148.27,31.75 139.38,31.75 v139.06,31.43
ADDR3  (via drill 0.25)
  Top 0.127: IC25.3 143.51,3.81 143.51,8.57 | 143.51,8.57 143.51,52.07 IC35.3 | IC20.3 87.63,3.81 v87.63,8.57 87.63,17.78 | 87.63,17.78 87.63,52.07 IC10.3 | X2.A6 6.35,29.21 6.35,13.65 7.94,12.06 v7.94,9.53 | v61.28,7.62 v59.05,5.4 | 143.51,8.57 140.97,8.57 140.97,15.88 137.79,19.05 135.89,19.05 v135.89,18.41 | 87.63,17.78 v87.31,17.78
  Bottom 0.127: v7.94,9.53 11.11,6.35 53.02,6.35 55.56,3.81 57.47,3.81 v59.05,5.4 | v61.28,7.62 61.91,8.26 80.33,8.26 80.96,8.89 82.55,8.89 83.19,8.26 87.31,8.26 v87.63,8.57 | v135.89,18.41 134.62,17.14 112.71,17.14 112.08,16.51 107.31,16.51 106.05,17.78 v87.31,17.78
ADDR4  (via drill 0.25)
  Top 0.127: IC26.9 161.29,16.51 161.29,64.77 IC36.9 | v102.23,17.14 102.55,17.46 102.55,43.81 | 102.55,43.81 102.55,63.18 104.14,64.77 IC9.9 | v40.32,33.34 41.59,34.61 41.59,37.78 39.69,39.69 39.69,41.59 v41.27,43.18 | 102.55,43.81 v100.97,43.81
  Route15 0.127: IC36.9 158.12,64.14 v127.64,64.14
  Bottom 0.127: v102.23,17.14 IC19.9 | X2.A7 6.35,34.29 34.29,34.29 35.24,33.34 v40.32,33.34 | v41.27,43.18 42.23,42.23 54.61,42.23 55.24,41.59 57.47,41.59 58.42,42.55 80.33,42.55 80.96,41.91 82.55,41.91 84.45,43.81 95.57,43.81 95.89,44.13 100.65,44.13 v100.97,43.81 | v127.64,64.14 127.32,64.45 105.73,64.45 IC9.9
ADDR5  (via drill 0.25)
  Top 0.127: IC26.7 155.26,15.56 155.26,21.27 156.21,22.23 156.21,62.87 154.94,64.14 IC36.7 | IC19.7 100.33,16.51 100.33,20.64 | 100.33,20.64 100.33,64.77 IC9.7 | v45.09,32.38 44.77,32.07 44.77,25.72 46.67,23.81 v46.67,20.32 | 100.33,20.64 v101.92,20.64
  Route15 0.127: IC26.7 153.03,17.14 139.38,17.14 137.79,18.73 136.21,18.73 v134.62,20.32
  Bottom 0.127: X2.A8 6.03,34.61 34.61,34.61 35.24,33.97 43.5,33.97 v45.09,32.38 | v46.67,20.32 47.94,19.05 79.69,19.05 80.33,18.41 80.01,18.1 80.01,17.14 80.33,17.14 80.96,16.51 82.55,16.51 83.19,17.14 97.16,17.14 IC19.7 | v134.62,20.32 133.99,20.95 112.71,20.95 112.08,21.59 107.95,21.59 107,20.64 v101.92,20.64
ADDR6  (via drill 0.25)
  Top 0.127: IC26.5 150.81,16.19 150.81,40.96 151.13,41.27 151.13,64.77 IC36.5 149.54,66.36 v149.54,69.85 | IC19.5 95.25,16.51 95.25,63.82 93.98,65.09 IC9.5 | v16.51,39.05 20.32,42.86 v20.32,49.85 | v61.28,51.75 62.23,52.7 v62.23,63.18
  Bottom 0.127: X2.A9 6.03,39.05 v16.51,39.05 | v20.32,49.85 22.23,51.75 v61.28,51.75 | v62.23,63.18 62.87,63.82 95.89,63.82 96.52,63.18 100.65,63.18 102.55,65.09 102.55,67.63 | 102.55,67.63 95.57,67.63 IC9.5 | v149.54,69.85 149.22,69.53 139.7,69.53 137.48,67.31 136.84,67.31 136.21,67.94 113.35,67.94 112.39,66.99 107.63,66.99 107,67.63 102.55,67.63
ADDR7  (via drill 0.25)
  Top 0.127: IC26.3 143.83,16.19 143.83,44.45 | 143.83,44.45 143.83,50.48 145.73,52.39 145.73,65.09 IC36.3 | IC19.3 87.95,16.19 87.95,37.78 90.17,40.01 90.17,44.45 | 90.17,44.45 90.17,50.16 92.39,52.39 92.39,57.15 v91.76,57.78 | v90.17,58.74 89.85,59.05 89.85,65.09 IC9.3 | v20,39.69 24.13,43.81 v24.13,44.13 | 90.17,44.45 v88.58,44.45 | v144.15,44.45 143.83,44.45
  Bottom 0.127: v91.76,57.78 90.81,58.74 v90.17,58.74 | X2.A10 6.03,39.69 v20,39.69 | v24.13,44.13 24.45,44.45 v88.58,44.45 v144.15,44.45
ADDR8  (via drill 0.25)
  Top 0.127: IC27.9 160.97,28.89 160.97,63.18 159.07,65.09 159.07,76.2 160.02,77.15 IC37.9 | v120.65,76.83 v120.65,27.3
  Route2 0.127: IC37.9 156.53,75.25 122.24,75.25 v120.65,76.83
  Route15 0.127: v73.03,24.77 93.03,24.77 94.61,26.35 102.55,26.35 IC18.9
  Bottom 0.127: IC18.9 105.73,26.35 119.7,26.35 v120.65,27.3 | v120.65,76.83 120.33,77.15 105.73,77.15 IC8.9 | X2.A11 5.08,41.59 4.45,41.59 4.13,41.27 4.13,26.67 14.92,26.67 15.88,25.72 63.82,25.72 64.14,26.04 64.77,26.04 66.04,24.77 v73.03,24.77
ADDR9  (via drill 0.25)
  Top 0.127: v156.84,29.53 156.53,29.84 156.53,57.78 | 156.53,57.78 156.53,63.18 155.89,63.82 155.89,77.79 IC37.7 | 100.01,57.78 100.01,63.18 98.11,65.09 98.11,77.79 IC8.7 | 100.01,57.78 100.01,28.89 IC18.7 98.11,26.99 98.11,14.29 98.42,13.97 98.42,12.38 v98.74,12.06 | v64.14,25.4 64.45,25.08 64.45,13.97 v64.14,13.65 | v156.84,57.78 156.53,57.78 | 100.01,57.78 v99.69,57.78
  Bottom 0.127: IC27.7 156.53,29.53 v156.84,29.53 | X2.A12 5.08,44.13 4.45,44.13 3.81,43.5 3.81,26.35 14.61,26.35 15.56,25.4 v64.14,25.4 | v64.14,13.65 65.41,12.38 85.72,12.38 86.04,12.06 v98.74,12.06 | v156.84,57.78 156.53,58.1 139.06,58.1 137.48,59.69 133.35,59.69 131.13,57.47 112.39,57.47 112.08,57.15 103.82,57.15 103.19,57.78 v99.69,57.78
ADDR10  (via drill 0.25)
  Top 0.127: v151.45,29.53 151.45,75.88 149.86,77.47 IC37.5 | IC18.5 94.93,28.89 94.93,63.18 93.03,65.09 93.03,68.26 | 93.03,68.26 93.03,77.79 IC8.5 | v79.06,43.81 79.38,44.13 79.38,76.2 v84.14,80.96 | 93.03,68.26 v94.61,68.26
  Route15 0.127: IC37.5 146.05,74.93 v146.05,74.61
  Bottom 0.127: v151.45,29.53 IC27.5 | X2.A13 6.35,46.99 20.64,46.99 24.13,43.5 37.15,43.5 37.47,43.81 53.66,43.81 55.56,41.91 57.15,41.91 59.05,43.81 v79.06,43.81 | v84.14,80.96 84.45,80.64 92.08,80.64 IC8.5 | v146.05,74.61 146.05,71.75 138.11,71.75 137.48,72.39 133.35,72.39 132.4,71.44 113.67,71.44 112.08,69.85 100.65,69.85 99.06,68.26 v94.61,68.26
ADDR11  (via drill 0.25)
  Top 0.127: IC37.3 143.51,77.47 143.51,60.33 140.97,57.78 v140.97,29.21 140.65,28.89 140.65,26.99 140.02,26.35 138.75,26.35 v134.62,30.48 | v86.36,30.48 87.31,31.43 87.31,46.04 | 87.31,46.04 87.31,56.2 87.63,56.52 87.63,77.47 IC8.3 | 87.31,46.04 v86.04,46.04
  Route2 0.127: v86.36,30.48 IC18.3
  Bottom 0.127: IC27.3 143.19,29.53 141.29,29.53 v140.97,29.21 | X2.A14 6.67,49.21 25.08,49.21 28.26,46.04 54.61,46.04 55.56,46.99 57.78,46.99 58.42,46.35 80.33,46.35 80.96,46.99 82.55,46.99 83.5,46.04 v86.04,46.04 | v134.62,30.48 134.3,30.16 113.67,30.16 112.39,28.89 108.27,28.89 106.68,30.48 v86.36,30.48
ADDR12  (via drill 0.25)
  Top 0.127: v161.93,42.23 161.61,42.55 161.61,89.85 IC38.9 | IC17.9 105.09,41.59 105.09,75.88 105.41,76.2 105.41,76.83 | 105.41,80.96 105.41,90.17 IC7.9 | 105.41,80.96 105.41,76.83 | v32.7,54.93 33.97,56.2 33.97,70.17 v33.66,70.48 | v100.97,71.44 100.65,71.75 100.65,74.61 102.87,76.83 105.41,76.83 | v143.51,84.45 v143.51,92.08 | 105.41,80.96 v106.36,80.96
  Bottom 0.127: IC28.9 161.61,42.23 v161.93,42.23 | X2.A15 6.67,54.93 v32.7,54.93 | v33.66,70.48 33.97,70.17 55.24,70.17 55.56,69.85 59.69,69.85 61.28,68.26 75.56,68.26 77.15,69.85 96.84,69.85 98.42,71.44 v100.97,71.44 | IC38.9 160.02,93.34 144.78,93.34 v143.51,92.08 | v143.51,84.45 138.11,84.45 137.48,85.09 136.84,85.09 135.57,83.82 135.57,81.92 135.25,81.92 134.3,80.96 113.03,80.96 112.08,80.01 111.12,80.01 110.17,80.96 v106.36,80.96
ADDR13  (via drill 0.25)
  Top 0.127: IC28.7 155.89,41.59 155.89,62.55 153.99,64.45 153.99,90.49 IC38.7 153.03,93.34 v153.03,94.61 | IC17.7 98.11,41.59 98.11,50.48 v98.42,50.8 | v97.16,51.12 97.79,51.75 97.79,69.53 | 97.79,69.53 97.79,79.69 97.47,80.01 97.47,89.85 IC7.7 | v80.01,58.42 80.01,65.41 v82.23,67.63 | 97.79,69.53 v97.16,69.53
  Bottom 0.127: v98.42,50.8 98.11,51.12 v97.16,51.12 | X2.A16 6.67,57.47 20,57.47 20.64,58.1 54.61,58.1 55.56,57.15 59.69,57.15 60.96,58.42 v80.01,58.42 | v82.23,67.63 84.14,69.53 v97.16,69.53 | v153.03,94.61 152.4,95.25 125.73,95.25 124.14,93.66 113.67,93.66 112.39,92.39 107.63,92.39 107,93.03 100.65,93.03 IC7.7
ADDR14  (via drill 0.25)
  Top 0.127: IC28.5 150.81,41.59 150.81,63.18 148.91,65.09 148.91,90.49 IC38.5 | v95.89,43.5 95.57,43.81 95.57,50.16 97.47,52.07 97.47,62.23 95.25,64.45 95.25,83.5 | 95.25,83.5 95.25,90.17 IC7.5 | X2.A17 6.67,60.01 v6.67,80.33 | 95.25,83.5 v92.39,83.5 | v138.43,42.86 137.48,41.91 135.57,41.91 v135.57,42.23
  Route2 0.127: IC17.5 95.89,42.55 v95.89,43.5
  Bottom 0.127: v6.67,80.33 30.48,80.33 32.7,82.55 53.02,82.55 55.56,85.09 57.78,85.09 58.42,84.45 80.33,84.45 80.96,85.09 81.6,85.09 83.19,83.5 v92.39,83.5 | IC28.5 147.64,42.86 v138.43,42.86 | v135.57,42.23 135.25,42.55 113.35,42.55 112.39,41.59 110.81,41.59 109.86,42.55 96.84,42.55 v95.89,43.5
ADDR15  (via drill 0.25)
  Top 0.127: IC28.3 145.73,41.59 145.73,49.85 148.59,52.7 148.59,87.63 IC38.3 | IC17.3 87.95,41.59 87.95,45.4 | 87.95,45.4 87.95,50.48 89.85,52.39 v89.85,55.56 | v87,56.52 87.31,56.83 87.31,79.06 87.95,79.69 87.95,87.63 88.9,88.58 IC7.3 88.9,93.66 87.95,94.61 87.95,100.65 86.04,100.65 85.41,100.01 85.41,98.74 82.87,96.2 82.87,87.95 v78.74,83.82 | 87.95,45.4 v89.22,45.4
  Route15 0.127: IC28.3 143.19,42.23 136.53,42.23 v133.67,45.09
  Bottom 0.127: v89.85,55.56 88.9,56.52 v87,56.52 | X2.A18 3.17,62.87 3.17,79.69 30.48,79.69 33.02,82.23 55.24,82.23 55.56,82.55 60.96,82.55 62.23,83.82 v78.74,83.82 | v133.67,45.09 133.35,45.4 113.67,45.4 112.08,46.99 107.95,46.99 106.36,45.4 v89.22,45.4
ADDR-ID0  (via drill 0.25)
  Top 0.127: v25.4,89.22 20.95,84.77 20.95,41.27 v16.51,36.83
  Bottom 0.127: IC41.2 33.34,89.22 v25.4,89.22 | v16.51,36.83 16.19,36.51 9.21,36.51 X2.B9
ADDR-ID1  (via drill 0.25)
  Top 0.127: v15.88,93.03 13.34,90.49 13.34,41.91 12.7,41.27 11.11,41.27 10.79,41.59 7.62,41.59 X2.B10
  Bottom 0.127: IC41.3 36.51,93.03 v15.88,93.03
ADDR-REG-FUNC  (via drill 0.25)
  Top 0.127: v38.42,84.77 38.42,79.06 IC46.2 37.15,77.79 37.15,64.45 36.2,63.5 36.2,62.87 36.51,62.55 36.51,39.05 32.07,39.05 v26.67,33.66 | IC41.1 33.34,91.12 v33.34,86.68
  Bottom 0.127: IC46.9 46.67,84.77 v38.42,84.77 35.24,84.77 v33.34,86.68 | X2.C7 10.79,33.66 v26.67,33.66
BUS-DIR  (via drill 0.25)
  Top 0.127: IC40.1 26.99,41.59 26.99,52.39 | IC45.1 26.99,52.39 | 26.99,65.09 IC44.1 | 26.99,52.39 26.99,65.09 | v29.84,77.47 26.99,74.61 26.99,65.09
  Bottom 0.127: IC46.6 46.67,77.15 30.16,77.15 v29.84,77.47
DATA0  (via drill 0.25)
  Top 0.127: IC45.2 29.53,54.29 29.53,62.55 | 29.53,62.55 29.53,65.09 IC44.2 | 29.53,62.55 v27.62,62.55
  Bottom 0.127: X2.A19 6.03,62.55 v27.62,62.55
DATA1
  Top 0.127: IC45.3 32.07,54.29 32.07,65.09 IC44.3
  Bottom 0.127: X2.A20 6.67,64.45 31.43,64.45 IC44.3
DATA2
  Top 0.127: IC45.4 34.61,54.29 34.61,65.09 IC44.4
  Bottom 0.127: X2.A21 5.08,66.99 26.99,66.99 27.62,67.63 33.97,67.63 IC44.4
DATA3  (via drill 0.25)
  Top 0.127: IC45.5 37.15,54.29 37.15,62.55 38.1,63.5 IC44.5 | X2.A22 6.03,70.17 v6.03,69.22
  Bottom 0.127: v6.03,69.22 6.03,67.31 26.67,67.31 27.3,67.94 36.2,67.94 IC44.5
DATA4  (via drill 0.25)
  Top 0.127: IC45.6 39.69,54.29 39.69,65.09 IC44.6 40.64,68.58 v40.01,69.22
  Bottom 0.127: X2.A23 6.03,72.71 26.99,72.71 30.48,69.22 v40.01,69.22
DATA5
  Top 0.127: IC45.7 43.18,59.05 42.23,60.01 42.23,65.09 IC44.7
  Bottom 0.127: X2.A24 5.08,74.61 4.45,74.61 4.13,74.3 4.13,72.39 26.67,72.39 30.48,68.58 45.09,68.58 46.67,66.99 46.67,64.45 44.77,64.45 IC44.7
DATA6
  Top 0.127: IC45.8 44.77,54.29 44.77,63.5 45.72,64.45 IC44.8
  Bottom 0.127: X2.A25 3.49,77.15 3.49,69.85 28.26,69.85 29.84,68.26 43.5,68.26 IC44.8
DATA7  (via drill 0.25)
  Top 0.127: IC45.9 47.31,54.29 47.31,63.82 48.26,64.77 IC44.9 47.31,66.99 47.31,82.23 v46.35,83.19
  Bottom 0.127: X2.A26 6.03,82.23 31.75,82.23 32.7,83.19 v46.35,83.19
DATA8  (via drill 0.25)
  Top 0.127: IC40.2 28.89,39.05 26.67,39.05 v26.67,82.87
  Bottom 0.127: v26.67,82.87 6.03,82.87 X2.A27
DATA9  (via drill 0.25)
  Top 0.127: IC40.3 28.89,44.77 v28.89,58.74
  Bottom 0.127: v28.89,58.74 28.57,59.05 11.11,59.05 10.16,60.01 4.45,60.01 2.86,61.59 2.86,86.36 X2.A28
DATA10  (via drill 0.25)
  Top 0.127: IC40.4 34.29,41.91 34.29,75.56 32.38,77.47 v32.38,84.77
  Bottom 0.127: v32.38,84.77 29.53,87.63 6.35,87.63 X2.A29
DATA11  (via drill 0.25)
  Top 0.127: v12.7,41.91 11.11,43.5 11.11,89.53 10.16,90.49 5.08,90.49 X2.A30
  Bottom 0.127: IC40.5 36.51,42.23 13.02,42.23 v12.7,41.91
DATA12  (via drill 0.25)
  Top 0.127: IC40.6 41.91,39.37 v41.91,21.27
  Bottom 0.127: v41.91,21.27 33.66,21.27 33.02,21.91 8.57,21.91 X2.B3
DATA13  (via drill 0.25)
  Top 0.127: v6.99,41.59 6.67,41.27 6.67,26.35 X2.B4
  Bottom 0.127: IC40.7 41.27,42.55 11.11,42.55 10.16,41.59 v6.99,41.59
DATA14  (via drill 0.25)
  Top 0.127: v45.72,38.42 IC40.8 | v9.53,37.15 8.57,36.2 8.57,28.89 X2.B5
  Bottom 0.127: v45.72,38.42 45.72,37.47 11.11,37.47 10.79,37.15 v9.53,37.15
DATA15  (via drill 0.25)
  Top 0.127: IC40.9 47.31,39.69 v47.31,33.34
  Bottom 0.127: v47.31,33.34 45.72,31.75 8.89,31.75 X2.B6
GND  (102 unrouted)
  pour Route15: 1.27,113.03 176.53,113.03 176.53,0 0,0 0,113.03
H/L-SWAP  (via drill 0.25)
  Top 0.127: IC46.10 46.99,87.63 46.99,104.14 53.34,110.49 v53.34,113.03 53.34,113.35 14.92,113.35 10.48,108.9 10.48,106.68 4.13,100.33 4.13,87.95 7.62,87.95 8.57,87 8.57,80.33 X2.C25
  Bottom 0.127: v53.34,113.03 53.66,113.35 55.56,113.35 IC42.11
IREG0  (via drill 0.25)
  Top 0.127: IC30.4 101.6,105.73 95.57,105.73 IC30.1 88.58,109.54 83.5,109.54 | 76.83,108.58 77.47,109.22 IC39.12 | 76.83,108.58 IC39.1 | 79.38,104.78 78.11,106.05 78.11,107.31 76.83,108.58 | 79.38,104.78 IC39.4 | IC39.9 83.5,110.17 83.5,109.54 | 83.5,109.54 83.5,108.9 79.38,104.78 | IC11.1 34.61,16.19 34.61,36.51 36.83,38.73 v36.83,62.87 | v60.33,63.18 62.23,65.09 IC42.6
  Bottom 0.127: v36.83,62.87 37.15,63.18 v60.33,63.18 | IC39.1 71.12,105.41 65.41,105.41 65.09,105.73 63.82,105.73 IC42.6
IREG1  (via drill 0.25)
  Top 0.127: 120.65,107.95 121.92,109.22 IC29.12 | 120.65,107.95 IC29.1 | 120.65,107.95 IC29.4 | IC11.4 44.45,16.51 44.45,64.14 44.77,64.45 44.77,100.01 45.72,100.97 45.72,107 46.67,107.95 v47.94,107.95
  Bottom 0.127: IC29.9 127.95,113.35 123.51,113.35 | IC29.12 123.51,113.35 | 123.51,113.35 108.27,113.35 IC30.9 105.09,113.35 100.65,113.35 IC30.12 97.47,113.35 66.36,113.35 IC42.8 62.87,109.86 49.85,109.86 v47.94,107.95
N$1
  Top 0.127: IC46.11 IC46.4
N$2
  Top 0.127: IC22.4 IC21.13
N$3
  Top 0.127: IC22.5 IC21.12
N$4
  Top 0.127: IC23.4 IC22.13
N$5
  Top 0.127: IC23.5 IC22.12
N$6
  Top 0.127: IC24.4 IC23.13
N$7
  Top 0.127: IC24.5 IC23.12
N$8
  Top 0.127: IC21.11 125.73,11.43 125.73,21.59 | IC22.11 125.73,21.59 | IC29.3 123.51,102.55 123.51,81.6 125.73,79.38 125.73,21.59
N$9
  Top 0.127: IC21.5 125.41,3.49 125.41,70.8 123.19,73.03 123.19,95.89 120.33,98.74 120.33,100.01 117.79,102.55 110.17,102.55 110.17,110.81 IC30.8
N$10
  Top 0.127: IC5.4 IC6.13
N$11
  Top 0.127: IC5.5 IC6.12
N$12
  Top 0.127: IC4.4 IC5.13
N$13
  Top 0.127: IC4.5 IC5.12
N$14
  Top 0.127: IC3.4 IC4.13
N$15
  Top 0.127: IC3.5 IC4.12
N$16  (via drill 0.25)
  Top 0.127: IC1.3 41.59,26.99 41.59,21.59 41.27,21.27 41.91,20.64 42.55,20.64 42.55,21.59 42.23,21.91 v42.23,46.67 | v71.75,50.16 72.07,50.48 72.07,60.01 | IC6.11 72.07,60.01 | IC5.11 71.12,67.94 72.07,66.99 72.07,60.01
  Bottom 0.127: v42.23,46.67 42.23,50.16 v71.75,50.16
N$17  (via drill 0.25)
  Top 0.127: IC2.3 41.59,3.49 41.59,17.46 v41.27,17.78 | v65.41,20.32 67.31,22.23 67.31,32.38 69.53,34.61 69.53,52.39 IC6.5
  Bottom 0.127: v41.27,17.78 44.45,20.95 54.93,20.95 55.56,21.59 57.47,21.59 58.74,20.32 v65.41,20.32
N$18
  Top 0.127: IC2.6 49.85,0.95 56.52,0.95 57.15,1.59 57.47,1.59 58.1,0.95 62.55,0.95 62.55,7.3 64.77,9.53 64.77,52.07 IC6.4
N$19  (via drill 0.25)
  Top 0.127: IC10.19 85.41,61.91 85.41,72.71 IC9.19 85.41,74.61 85.41,88.9 | IC1.6 53.34,33.02 53.34,88.27 58.1,93.03 60.01,93.03 60.01,90.49 v60.64,89.85 | v86.68,88.58 86.36,88.27 86.36,87.95 | IC8.19 86.36,87.95 | IC7.19 85.41,98.11 85.41,88.9 | 86.36,87.95 85.41,88.9
  Bottom 0.127: v60.64,89.85 61.28,89.22 65.09,89.22 66.04,88.27 86.36,88.27 v86.68,88.58
N$20  (via drill 0.25)
  Top 0.127: v83.5,33.34 84.77,34.61 84.77,52.39 | IC10.1 84.77,52.39 | IC9.1 84.77,65.09 84.77,52.39
  Bottom 0.127: IC1.11 44.77,33.97 55.24,33.97 55.56,34.29 57.78,34.29 58.42,33.66 80.33,33.66 80.96,34.29 82.55,34.29 v83.5,33.34
N$21  (via drill 0.25)
  Top 0.127: v79.06,37.78 82.87,41.59 82.87,77.79 IC8.1 84.77,79.69 84.77,90.49 IC7.1
  Bottom 0.127: IC1.8 52.39,37.15 74.61,37.15 75.25,37.78 v79.06,37.78
N$22  (via drill 0.25)
  Top 0.127: IC11.11 44.13,23.81 44.13,64.45 44.45,64.77 v44.45,100.33 | IC4.11 70.17,87.31 70.17,98.11 IC3.11
  Bottom 0.127: v44.45,100.33 44.77,100.65 69.53,100.65 IC3.11
N$23
  Top 0.127: IC21.4 115.25,9.21 115.25,12.38 107.95,19.68 107.95,92.08 105.41,94.61 105.41,106.36 101.6,110.17 IC30.11
N$24  (via drill 0.25)
  Top 0.127: IC25.19 143.19,11.11 143.19,21.91 IC26.19 141.29,23.81 141.29,28.89 142.24,29.84 IC27.19 141.29,36.51 141.29,47.31 IC28.19 | IC29.6 130.49,103.19 130.49,56.52 v130.18,56.2
  Route2 0.127: v130.18,56.2 133.99,56.2 141.92,48.26 IC28.19
N$25
  Top 0.127: IC25.1 140.65,3.49 140.65,14.29 IC26.1 135.25,15.24 128.27,22.23 128.27,79.38 125.73,81.92 125.73,104.78 125.09,105.41 125.09,111.12 IC29.11
N$26
  Top 0.127: IC27.1 140.34,28.57 140.34,34.29 140.65,34.61 140.65,39.69 IC28.1 139.7,45.72 134.3,51.12 134.3,103.82 132.08,106.05 IC29.8
N$27  (via drill 0.25)
  Top 0.127: IC11.6 52.07,19.05 58.74,19.05 v58.74,20.95 | v126.36,20.32 127.95,21.91 127.95,24.77 126.05,26.67 126.05,34.61 | IC23.11 126.05,34.61 | IC24.11 126.05,47.31 126.05,34.61
  Bottom 0.127: v58.74,20.95 80.33,20.95 80.96,21.59 82.55,21.59 84.14,20 110.49,20 111.44,19.05 117.16,19.05 118.43,20.32 v126.36,20.32
N$28
  Top 0.127: IC32.4 IC31.13
N$29
  Top 0.127: IC32.5 IC31.12
N$30
  Top 0.127: IC33.4 IC32.13
N$31
  Top 0.127: IC33.5 IC32.12
N$32
  Top 0.127: IC34.4 IC33.13
N$33
  Top 0.127: IC34.5 IC33.12
N$34  (via drill 0.25)
  Top 0.127: IC31.11 126.05,61.91 126.05,72.71 | IC32.11 126.05,72.71 | IC39.3 77.79,103.82 77.79,96.52 79.06,95.25 82.23,95.25 v82.23,94.93 | v124.14,94.3 125.41,93.03 125.41,80.33 126.05,79.69 126.05,72.71
  Bottom 0.127: v82.23,94.93 82.55,95.25 108.27,95.25 110.81,92.71 112.08,92.71 113.67,94.3 v124.14,94.3
N$35  (via drill 0.25)
  Top 0.127: IC31.5 122.87,54.93 122.87,79.69 v120.97,81.6 | v104.78,82.55 102.87,84.45 102.87,100.97 102.23,101.6 102.23,101.92 101.6,102.55 99.06,102.55 IC30.3
  Bottom 0.127: v120.97,81.6 120.65,81.92 112.71,81.92 112.08,82.55 v104.78,82.55
N$36  (via drill 0.25)
  Top 0.127: v110.49,51.75 108.58,53.66 108.58,93.98 107.63,94.93 107.63,103.19 IC30.6
  Bottom 0.127: IC31.4 120.33,51.75 v110.49,51.75
N$37  (via drill 0.25)
  Top 0.127: IC35.19 141.29,61.91 141.29,72.71 IC36.19 141.29,74.61 141.29,87.31 | IC39.6 83.5,105.73 80.96,105.73 80.96,103.19 78.11,100.33 78.11,96.84 v79.06,95.89 | 141.29,96.84 142.24,96.84 IC38.19 | 141.29,96.84 v139.38,96.84 | 141.29,87.31 IC37.19 | 141.29,96.84 141.29,87.31
  Bottom 0.127: v79.06,95.89 80.96,97.79 82.55,97.79 83.19,97.16 110.81,97.16 111.44,97.79 112.08,97.79 112.71,97.16 136.21,97.16 136.84,97.79 137.48,97.79 138.43,96.84 v139.38,96.84
N$38  (via drill 0.25)
  Top 0.127: IC35.1 140.65,54.29 140.65,65.09 IC36.1 139.7,70.17 135.89,73.98 135.89,81.28 v134.94,82.23 | v82.23,109.54 IC39.11 | v102.87,109.54 108.27,109.54 108.27,94.93 113.35,89.85 v113.35,84.45
  Bottom 0.127: v102.87,109.54 v82.23,109.54 | v113.35,84.45 115.57,82.23 v134.94,82.23
N$39  (via drill 0.25)
  Top 0.127: IC37.1 138.75,79.69 138.75,90.49 | IC38.1 138.75,90.49 | v91.12,108.27 IC39.8 | v132.72,107.95 138.75,101.92 138.75,90.49
  Bottom 0.127: v91.12,108.27 91.44,107.95 v132.72,107.95
N$40  (via drill 0.25)
  Top 0.127: v40.64,17.78 IC11.3 | v65.41,24.77 65.09,25.08 65.09,32.7 67.63,35.24 67.63,80.96 72.07,85.41 72.07,101.6 v73.66,103.19 | v125.73,106.05 126.05,105.73 126.05,100.01 | IC34.11 126.05,100.01 | IC33.11 126.05,87.31 126.05,100.01
  Bottom 0.127: v40.64,17.78 44.13,21.27 53.98,21.27 57.47,24.77 v65.41,24.77 | v73.66,103.19 73.66,106.05 113.35,106.05 113.98,105.41 115.57,105.41 116.2,106.05 v125.73,106.05
N$41
  Bottom 0.127: PWR1.A 175.26,7.94 175.9,7.94 176.21,8.26 176.21,15.24 R2.1
N$42  (via drill 0.25)
  Top 0.127: IC40.19 30.48,51.44 31.43,52.39 31.43,60.01 IC45.19 31.75,62.23 v31.75,80.33
  Bottom 0.127: IC46.3 39.05,80.33 v31.75,80.33
N$44  (via drill 0.25)
  Top 0.127: v30.48,82.87 IC44.19
  Bottom 0.127: v30.48,82.87 31.75,84.14 48.58,84.14 IC46.8
N$45  (via drill 0.25)
  Top 0.127: IC46.1 34.61,79.69 34.61,104.46 34.29,104.78 v34.29,107
  Bottom 0.127: v34.29,107 37.78,110.49 48.9,110.49 49.21,110.17 58.1,110.17 IC42.10
N$47
  Top 0.127: IC46.5 45.72,84.45 47.31,86.04 47.31,88.58 49.85,91.12 49.85,102.55 51.12,103.82 51.12,107 54.61,110.49 IC42.12
N$58
  Top 0.127: IC15.4 IC16.13
N$59
  Top 0.127: IC15.5 IC16.12
N$60
  Top 0.127: IC14.4 IC15.13
N$61
  Top 0.127: IC14.5 IC15.12
N$62
  Top 0.127: IC13.4 IC14.13
N$63
  Top 0.127: IC13.5 IC14.12
N$64  (via drill 0.25)
  Top 0.127: IC12.3 18.1,3.49 v18.1,11.43 | IC15.11 70.17,21.91 70.17,11.11 IC16.11
  Bottom 0.127: v18.1,11.43 18.73,12.06 69.22,12.06 IC16.11
N$65  (via drill 0.25)
  Top 0.127: v63.18,6.99 68.58,6.99 IC16.5
  Bottom 0.127: IC2.8 51.75,9.21 57.47,9.21 59.69,6.99 v63.18,6.99
N$66  (via drill 0.25)
  Top 0.127: v63.18,6.35 66.04,3.49 IC16.4
  Bottom 0.127: IC2.11 44.77,8.57 55.24,8.57 55.56,8.89 57.15,8.89 59.69,6.35 v63.18,6.35
N$83  (via drill 0.25)
  Top 0.127: v57.15,0.95 57.47,0.95 57.78,0.64 85.09,0.64 85.09,8.89 85.41,9.21 | IC20.19 85.41,9.21 | 85.41,21.91 IC19.19 | 85.41,9.21 85.41,21.91 | 85.41,34.61 IC18.19 | 85.41,21.91 85.41,34.61 | IC17.19 85.41,47.31 85.41,34.61
  Bottom 0.127: IC12.6 28.57,0.64 56.83,0.64 v57.15,0.95
N$84  (via drill 0.25)
  Top 0.127: v25.4,13.97 IC12.11 | v79.69,18.41 80.01,18.1 80.01,17.46 82.23,15.24 82.87,15.24 | IC19.1 82.87,15.24 | IC20.1 83.82,8.26 82.87,9.21 82.87,15.24
  Bottom 0.127: v25.4,13.97 27.94,16.51 34.29,16.51 34.92,17.14 54.93,17.14 55.56,16.51 57.15,16.51 59.05,18.41 v79.69,18.41
N$85  (via drill 0.25)
  Top 0.127: IC12.8 32.38,13.34 v32.38,13.97 | v79.06,17.78 79.06,23.18 82.87,26.99 | IC18.1 82.87,26.99 | IC17.1 82.87,39.69 82.87,26.99
  Bottom 0.127: v32.38,13.97 35.24,16.83 54.61,16.83 55.24,16.19 57.47,16.19 59.05,17.78 v79.06,17.78
N$86  (via drill 0.25)
  Top 0.127: v54.93,26.99 IC11.8 | 70.17,32.38 71.12,33.34 IC14.11 | 70.17,32.38 v67.94,30.16 | IC13.11 70.17,47.31 70.17,32.38
  Bottom 0.127: v54.93,26.99 58.1,30.16 v67.94,30.16
PC  (via drill 0.25)
  Top 0.127: IC12.12 21.59,7.62 IC12.4 | IC11.9 47.31,21.91 47.31,11.11 IC2.9 | v41.27,102.87 39.37,100.97 39.37,11.43 IC2.12
  Bottom 0.127: IC12.1 15.56,4.13 20,4.13 IC12.4 | IC12.12 20.64,11.75 25.08,11.75 IC12.9 28.26,11.75 42.23,11.75 | 42.23,11.75 IC2.12 | 42.23,11.75 46.67,11.75 IC2.9 | IC42.2 50.48,102.55 41.59,102.55 v41.27,102.87
R0D0  (via drill 0.25)
  Top 0.127: IC10.17 91.12,60.64 91.12,54.93 90.49,54.29 v90.49,52.07 | v138.75,55.88 137.48,57.15 v134.94,57.15 | v113.67,56.83 113.35,56.52 v113.35,54.61
  Bottom 0.127: IC6.7 75.25,51.75 90.49,51.75 | 100.01,51.75 90.49,51.75 | IC10.8 100.01,51.75 | 90.49,51.75 v90.49,52.07 | JP1.5 173.67,51.12 175.9,51.12 176.21,51.44 176.21,53.02 173.99,53.02 173.35,53.66 164.78,53.66 162.88,55.56 139.06,55.56 v138.75,55.88 | v134.94,57.15 134.62,56.83 v113.67,56.83 | v113.35,54.61 111.12,52.39 107.63,52.39 107,51.75 100.01,51.75
R0D1  (via drill 0.25)
  Top 0.127: v95.89,51.12 96.52,51.75 IC10.6 IC10.15
  Route2 0.127: v144.46,46.67 142.24,44.45 140.34,44.45 134.94,49.85 97.16,49.85 v95.89,51.12
  Bottom 0.127: IC6.6 73.03,51.44 95.57,51.44 v95.89,51.12 | JP1.7 172.09,50.16 157.48,50.16 156.21,48.9 156.21,46.35 144.78,46.35 v144.46,46.67
R0D2  (via drill 0.25)
  Top 0.127: IC10.13 101.28,60.64 v101.28,56.52
  Route2 0.127: v140.34,45.09 133.67,51.75 111.12,51.75 106.36,56.52 v101.28,56.52
  Bottom 0.127: IC6.2 62.55,54.93 80.64,54.93 80.96,54.61 83.19,54.61 83.5,54.93 89.85,54.93 | IC10.4 89.85,54.93 | v101.28,56.52 99.69,54.93 89.85,54.93 | JP1.9 172.4,46.67 163.51,46.67 162.56,45.72 157.48,45.72 156.84,45.09 v140.34,45.09
R0D3  (via drill 0.25)
  Top 0.127: v85.41,50.8 86.36,51.75 IC10.2 | IC10.11 105.73,60.01 v105.73,50.48 | v138.43,43.81 137.79,44.45 135.89,44.45 v135.89,45.09 | v117.47,46.04 117.79,46.35 117.79,49.21 v116.52,50.48
  Bottom 0.127: IC6.3 66.04,50.8 v85.41,50.8 86.04,50.16 105.41,50.16 v105.73,50.48 v116.52,50.48 | JP1.11 157.48,44.45 156.21,43.18 139.06,43.18 v138.43,43.81 | v135.89,45.09 134.94,46.04 v117.47,46.04
R0D4  (via drill 0.25)
  Top 0.127: IC9.17 90.49,72.71 v90.49,64.77
  Route15 0.127: v140.34,43.81 140.34,44.45 133.03,51.75 124.78,51.75 112.08,64.45 103.19,64.45 IC9.8
  Bottom 0.127: IC5.7 75.25,64.45 90.49,64.45 | 90.49,64.45 100.01,64.45 IC9.8 | 90.49,64.45 v90.49,64.77 | JP1.13 174.31,43.5 175.9,43.5 176.21,43.81 176.21,45.4 157.8,45.4 156.84,44.45 144.78,44.45 144.15,43.81 v140.34,43.81
R0D5  (via drill 0.25)
  Top 0.127: v96.52,63.82 IC9.6 IC9.15 | v140.34,45.72 134.94,51.12 v134.94,55.88
  Route15 0.127: v101.28,55.56 97.47,59.37 97.47,62.87 v96.52,63.82
  Bottom 0.127: IC5.6 73.03,64.14 96.2,64.14 v96.52,63.82 | JP1.15 174.31,40.96 174.31,42.86 175.9,42.86 176.53,43.5 176.53,47.94 164.15,47.94 162.24,46.04 157.16,46.04 156.84,45.72 v140.34,45.72 | v134.94,55.88 134.62,55.56 113.03,55.56 112.08,54.61 107.95,54.61 107,55.56 v101.28,55.56
R0D6  (via drill 0.25)
  Top 0.127: IC9.13 v101.6,71.44 102.55,70.48 102.55,64.45 v102.87,64.14 | v147.96,37.78 148.27,38.1 148.27,41.59 v147.64,42.23 | v114.94,43.81 115.25,44.13 115.25,61.91 v113.98,63.18
  Bottom 0.127: IC5.2 62.55,67.63 80.64,67.63 81.28,66.99 82.87,66.99 83.5,67.63 89.85,67.63 90.81,66.67 | IC9.4 90.81,66.67 | v101.6,71.44 99.06,68.9 93.03,68.9 90.81,66.67 | JP1.17 172.4,37.15 153.67,37.15 153.35,37.47 148.27,37.47 v147.96,37.78 | v147.64,42.23 147.32,42.55 138.75,42.55 138.11,41.91 136.53,41.91 134.62,43.81 v114.94,43.81 | v113.98,63.18 113.03,64.14 v102.87,64.14
R0D7  (via drill 0.25)
  Top 0.127: IC5.3 65.41,64.14 v65.41,63.18 | v86.04,63.18 86.36,63.5 IC9.2 | IC9.11 105.73,72.71 v105.73,63.5
  Route15 0.127: v141.6,31.11 141.6,31.75 133.67,39.69 133.67,42.86 125.09,51.44 114.3,51.44 105.73,60.01 v105.73,63.5
  Bottom 0.127: v65.41,63.18 v86.04,63.18 86.36,62.87 105.09,62.87 v105.73,63.5 | JP1.19 173.67,35.24 175.9,35.24 176.21,34.92 176.21,32.7 151.13,32.7 149.54,31.11 148.91,31.11 148.59,30.8 141.92,30.8 v141.6,31.11
R0D8  (via drill 0.25)
  Top 0.127: IC8.17 90.49,85.41 v90.49,77.47 92.39,75.56 v92.39,67.63 | JP1.21 173.67,32.7 v173.67,53.98 | v133.67,69.53 v133.67,59.05